# Altium project S7CAS-PLEIADES-CARTE-MERE.PrjPCB (part 1 of 3)
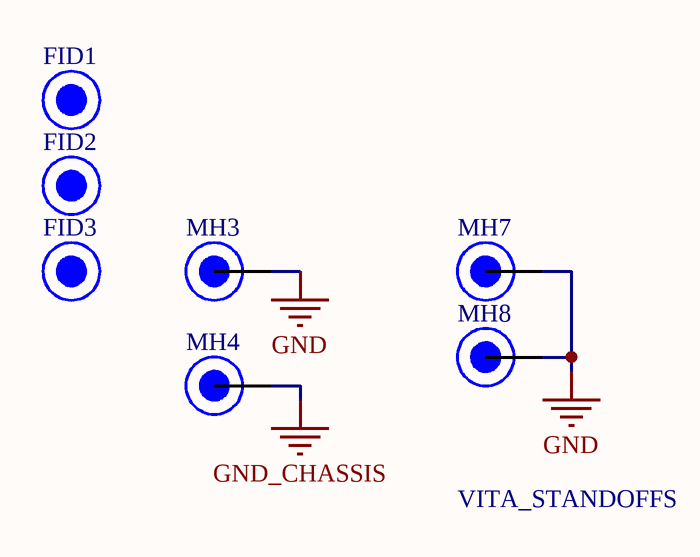
[diagram p0: CM_Title.SchDoc]
Project_Date: 2019-01-28; Project_DateCode: DCXXXX; Project_Designer1: Olivier Belval; Project_Designer2: Édouard Denommée; Project_Designer3: Philippe Marcoux; Project_Designer4: Anthony Paris; Project_Global: PLEIADES; Project_Group: P05; Project_Name: Carte Mère; Project_Revision: 1.000; Project_Stencil_Bot_Thickness: 0.1 MM; Project_Stencil_Top_Thickness: 0.1 MM
14 sheets, 327 parts. Net scope: flat (ports and power ports of the same name join across sheets).
Board file: CM_PCB.PcbDoc
Sheets:
  CM_Title.SchDoc
  CM_POWER_TREE.SchDoc
  CM_ALIM.SchDoc
  CM_FPGA_B0-1.SchDoc
  CM_FPGA_B2-3.SchDoc
  CM_FPGA_B4-5.SchDoc
  CM_FPGA_JTAG_POWER_FLASH.SchDoc
  CM_CLK.SchDoc
  CM_DDR3.SchDoc
  CM_MOTOR.SchDoc
  CM_ETHERNET.SchDoc
  CM_FMC-HPC-AB.SchDoc
  CM_FMC-HPC-CDE.SchDoc
  CM_USB.SchDoc

## Sheet CM_Title.SchDoc
size Tabloid; SheetNumber: 1; SheetTotal: 14; Sheet_Name: Insert name in Document Parameters; Size: 11x17

### Parts
FID1  Fiducial 1mm  [FID_1MM]  (value not drawn)  (no BOM)
FID2  Fiducial 1mm  [FID_1MM]  (value not drawn)  (no BOM)
FID3  Fiducial 1mm  [FID_1MM]  (value not drawn)  (no BOM)
MH3  Mounting Hole 6-32  [MH_ENG_6-32]  (value not drawn)  (no BOM)
MH4  Mounting Hole 6-32  [MH_ENG_6-32]  (value not drawn)  (no BOM)
MH7  2.7 mm  [MH_ENG_6-32]  (value not drawn)  (no BOM)
MH8  2.7 mm  [MH_ENG_6-32]  (value not drawn)  (no BOM)

### Nets
GND: MH3.1 MH7.1 MH8.1
GND_CHASSIS: MH4.1

### Notes on the sheet
- VITA_STANDOFFS
- Revision history
- Package size conversion
- Metric
- 1005
- 1608
- Imperial
- 0402
- 0603
- Revision
- 2012
- 3216
- 0805
- 1206
- 3225
- 6432
- 1210
- 2512
- Date :
- Project Title
- Global Project
- Size
- Group
- Date
- Sheet
- of
- Filename
- Designers

### Library data of the parts
FID1-FID3 = FID_1MM: FID - 1MM; Current: *; Mfg Part Number: *; HelpURL: *; CreatedBy: Jonathan Bouchard; VerifiedBy: Alexandre Imbeault; FootprintNameOK: Jonathan Bouchard; Temperature: *; Power: *; Precision: *; Value: *; Mfg: *; Package: *; Voltage: *
MH3 MH4 MH7 MH8 = MH_6-32: MH - Mounting Hole 6-32; Current: *; Mfg Part Number: *; HelpURL: *; CreatedBy: Jonathan Bouchard; VerifiedBy: Alexandre Imbeault; FootprintNameOK: Jonathan Bouchard; Temperature: *; Power: *; Precision: *; Value: *; Mfg: *; Package: *; Voltage: *

## Sheet CM_POWER_TREE.SchDoc
size Tabloid; SheetNumber: 2; SheetTotal: 14; Sheet_Name: Power tree
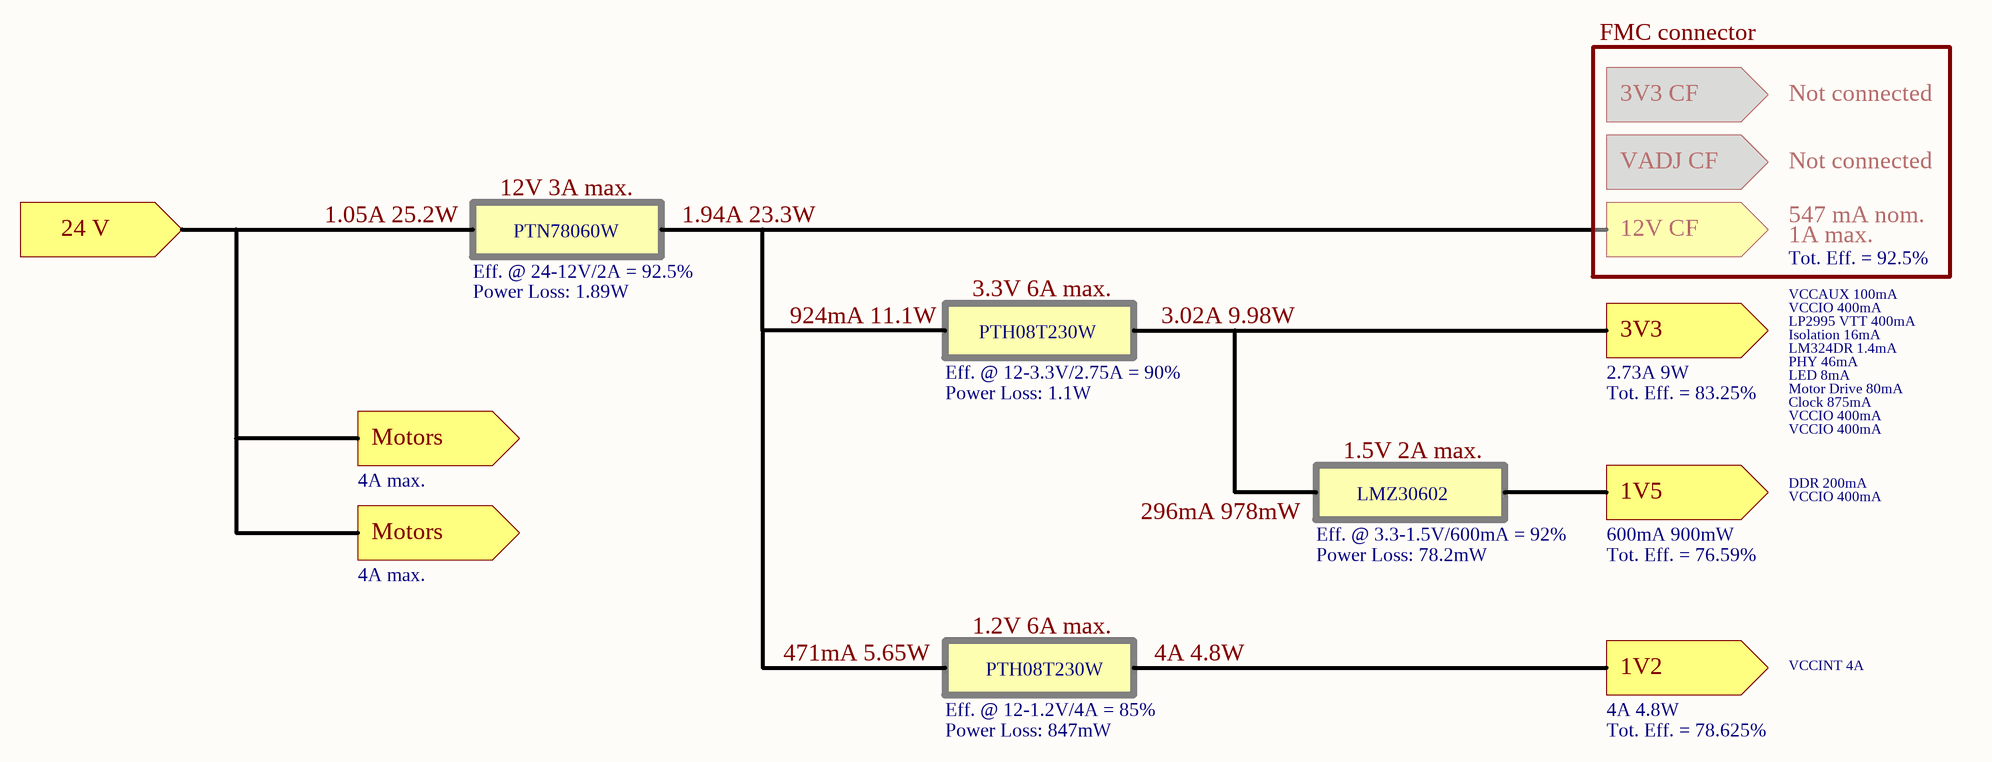
[diagram p1: CM_POWER_TREE.SchDoc]

### Notes on the sheet
- FMC connector
- 3V3 CF
- Not connected
- 12V 3A max.
- VADJ CF
- 24 V
- 1.05A 25.2W
- PTN78060W
- 1.94A 23.3W
- 12V CF
- 1A max.
- 547 mA nom.
- Tot. Eff. = 92.5%
- Eff. @ 24-12V/2A = 92.5%
- Power Loss: 1.89W
- 924mA 11.1W
- 3.3V 6A max.
- PTH08T230W
- 3.02A 9.98W
- 3V3
- VCCAUX 100mA
- VCCIO 400mA
- LP2995 VTT 400mA
- Isolation 16mA
- Eff. @ 12-3.3V/2.75A = 90%
- Power Loss: 1.1W
- Tot. Eff. = 83.25%
- 2.73A 9W
- LM324DR 1.4mA
- PHY 46mA
- LED 8mA
- Motor Drive 80mA
- Motors
- 1.5V 2A max.
- Clock 875mA
- 4A max.
- 296mA 978mW
- LMZ30602
- 1V5
- DDR 200mA
- Eff. @ 3.3-1.5V/600mA = 92%
- Power Loss: 78.2mW
- Tot. Eff. = 76.59%
- 600mA 900mW
- 471mA 5.65W
- 1.2V 6A max.
- 4A 4.8W
- VCCINT 4A
- Power Loss: 847mW
- Eff. @ 12-1.2V/4A = 85%
- Tot. Eff. = 78.625%
- 1V2
- Sheet Name
- Project Title
- Global Project
- Size
- Group
- Revision
- Date
- Sheet
- of
- Filename
- Designers

## Sheet CM_ALIM.SchDoc
size Tabloid; SheetNumber: 3; SheetTotal: 14; Size: 11x17; Sheet_Name: CM_ALIM
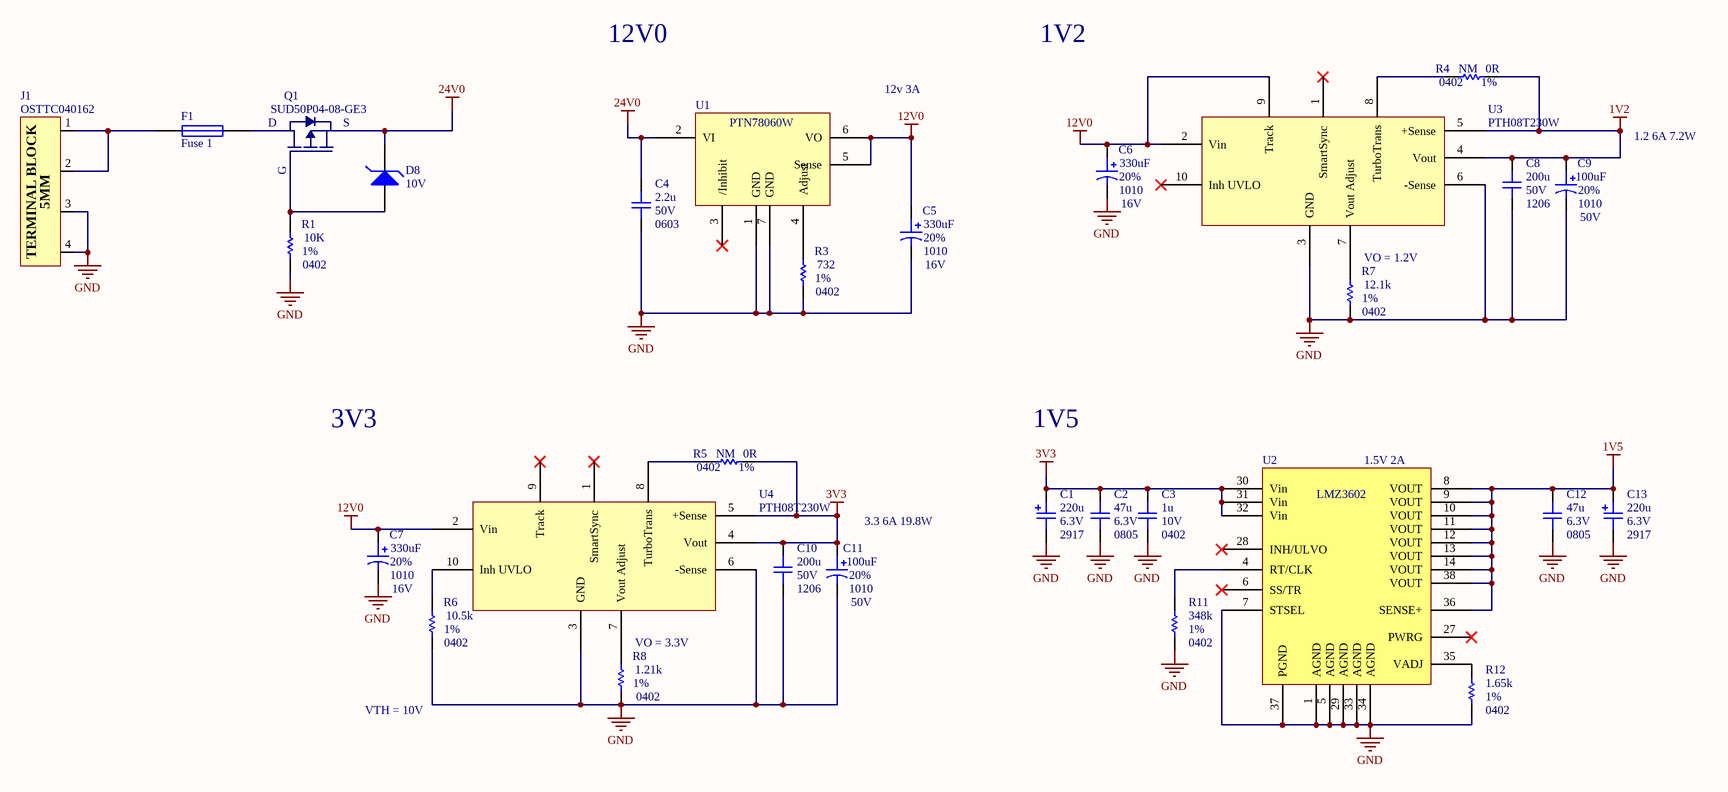
[diagram p2: CM_ALIM.SchDoc]

### Parts
C1  value 220u  Voltage: 6.3V  Package: 2917  [CAP_TAN_2917(D)]  (hidden comment: CAP - TANTALUM - CASE D)
C2  value 47u  Voltage: 6.3V  Package: 0805  [CAP_0805]  (hidden comment: CAP - 0805)
C3  value 1u  Voltage: 10V  Package: 0402  [CAP_0402]  (hidden comment: CAP - 0402)
C4  value 2.2u  Voltage: 50V  Package: 0603  [CAP_0603]  (hidden comment: CAP - 0603)
C5  value 330uF  Voltage: 16V  Package: 1010  Precision: 20%  [CAP_ALU_1010_vishay]  (hidden comment: MAL214699501E3)
C6  value 330uF  Voltage: 16V  Package: 1010  Precision: 20%  [CAP_ALU_1010_vishay]  (hidden comment: MAL214699501E3)
C7  value 330uF  Voltage: 16V  Package: 1010  Precision: 20%  [CAP_ALU_1010_vishay]  (hidden comment: MAL214699501E3)
C8  value 200u  Voltage: 50V  Package: 1206  [CAP_1206]  (hidden comment: CAP - 1206)
C9  value 100uF  Voltage: 50V  Package: 1010  Precision: 20%  [CAP_ALU_1010_vishay]  (hidden comment: MAL215099101E3)
C10  value 200u  Voltage: 50V  Package: 1206  [CAP_1206]  (hidden comment: CAP - 1206)
C11  value 100uF  Voltage: 50V  Package: 1010  Precision: 20%  [CAP_ALU_1010_vishay]  (hidden comment: MAL215099101E3)
C12  value 47u  Voltage: 6.3V  Package: 0805  [CAP_0805]  (hidden comment: CAP - 0805)
C13  value 220u  Voltage: 6.3V  Package: 2917  [CAP_TAN_2917(D)]  (hidden comment: CAP - TANTALUM - CASE D)
D8  Vz: 10V  [SOT23_N]  (hidden comment: ZENER BZX84C10LT1G)
F1  Fuse 1  [PIN-W2/E2.8]
J1  OSTTC040162  [CONN_TERMINAL_OSTTA040161]
Q1  SUD50P04-08-GE3  [TO-252]
R1  value 10K  Package: 0402  Precision: 1%  [RES_0402]  (hidden comment: RES - 0402)
R3  value 732  Package: 0402  Precision: 1%  [RES_0402]  (hidden comment: RES - 0402)
R4  NM  value 0R  Package: 0402  Precision: 1%  [RES_0402]
R5  NM  value 0R  Package: 0402  Precision: 1%  [RES_0402]
R6  value 10.5k  Package: 0402  Precision: 1%  [RES_0402]  (hidden comment: RES - 0402)
R7  value 12.1k  Package: 0402  Precision: 1%  [RES_0402]  (hidden comment: RES - 0402)
R8  value 1.21k  Package: 0402  Precision: 1%  [RES_0402]  (hidden comment: RES - 0402)
R11  value 348k  Package: 0402  Precision: 1%  [RES_0402]  (hidden comment: *)
R12  value 1.65k  Package: 0402  Precision: 1%  [RES_0402]  (hidden comment: *)
U1  PTN78060W  [EUW]
U2  LMZ3602  [RKG39 QFN]
U3  PTH08T230W  [PTH08T230W]
U4  PTH08T230W  [PTH08T230W]

### Nets
1V2: C8.2 C9.1 R4.1 U3.4(Vout) U3.5(+Sense)
1V5: C12.2 C13.2 U2.8(VOUT) U2.9(VOUT) U2.10(VOUT) U2.11(VOUT) U2.12(VOUT) U2.13(VOUT) U2.14(VOUT) U2.36(SENSE+) U2.38(VOUT)
3V3: C1.2 C2.2 C3.2 C10.2 C11.1 R5.1 U2.30(Vin) U2.31(Vin) U2.32(Vin) U4.4(Vout) U4.5(+Sense)
12V0: C5.1 C6.1 C7.1 U1.5(Sense) U1.6(VO) U3.2(Vin) U3.9(Track) U4.2(Vin)
24V0: C4.2 D8.3(K) Q1.S U1.2(VI)
GND: C1.1 C2.1 C3.1 C4.1 C5.2 C6.2 C7.2 C8.1 C9.2 C10.1 C11.2 C12.1 C13.1 J1.3 J1.4 R1.1 R3.1 R6.1 R7.1 R8.1 R11.1 R12.1 U1.1(GND) U1.7(GND) U2.1(AGND) U2.5(AGND) U2.7(STSEL) U2.29(AGND) U2.33(AGND) U2.34(AGND) U2.37(PGND) U3.3(GND) U3.6(-Sense) U4.3(GND) U4.6(-Sense)
NetD8_1: D8.1(A) Q1.G R1.2
NetF1_1: F1.1 J1.1 J1.2
NetF1_2: F1.2 Q1.D
NetR3_2: R3.2 U1.4(Adjust)
NetR4_2: R4.2 U3.8(TurboTrans)
NetR5_2: R5.2 U4.8(TurboTrans)
NetR6_2: R6.2 U4.10(Inh_UVLO)
NetR7_2: R7.2 U3.7(Vout_Adjust)
NetR8_2: R8.2 U4.7(Vout_Adjust)
NetR11_2: R11.2 U2.4(RT/CLK)
NetR12_2: R12.2 U2.35(VADJ)

Not connected (* = marked no-connect by the designer): U1 3(/Inhibit)*; U2 6(SS/TR)* 27(PWRG)* 28(INH/ULVO)*; U3 1(SmartSync)* 10(Inh_UVLO)*; U4 1(SmartSync)* 9(Track)*

### Notes on the sheet
- 12V0
- 1V2
- 12v 3A
- 1.2 6A 7.2W
- VO = 1.2V
- 3V3
- 1V5
- (near U2) 1.5V 2A
- (near C11) 3.3 6A 19.8W
- VO = 3.3V
- VTH = 10V
- Sheet Name
- Project Title
- Global Project
- Size
- Group
- Revision
- Date
- Sheet
- of
- Filename
- Designers
- (in symbol CONN_TERMINAL_OSTTC040162) TERMINAL BLOCK; 5MM

### Library data of the parts
C1 C13 = CAP_TANT_2917(D): CAP - TANTALUM - 2917; Precision: 10%; Current: *; CreatedBy: Jonathan Bouchard; Power: *
C2 C12 = CAP - 0805: Precision: 10%; Current: *; CreatedBy: Jonathan Bouchard; Power: *
C3 = CAP - 0402: Precision: 10%; Current: *; CreatedBy: Jonathan Bouchard; Power: *
C4 = CAP - 0603: Precision: 10%; Current: *; CreatedBy: Jonathan Bouchard; Power: *
C5-C7 = CAP_ALU_MAL214699501E3: CAP - ALU 330uF 20% 16V - 1010; Current: 750mA; Mfg: Vishay Dale; Mfg Part Number: MAL214699501E3; HelpURL: http://www.vishay.com/docs/28403/146cti.pdf; CreatedBy: Jonathan Bouchard; Temperature: -55°C to 125°C; Power: *; Supplier 1: Digikey; Supplier Part Number 1: 4405PHCT-ND
C8 C10 = CAP - 1206: Precision: 10%; Current: *; CreatedBy: Jonathan Bouchard; Power: *
C9 C11 = CAP_ALU_MAL215099101E3: CAP - ALU 100uF 20% 50V - 1010; Current: 490mA; Mfg: Vishay Dale; Mfg Part Number: MAL215099101E3; HelpURL: http://www.vishay.com/docs/28395/150crz.pdf; CreatedBy: Jonathan Bouchard; Temperature: -55°C to 125°C; Power: *; Supplier 1: Digikey; Supplier Part Number 1: 4399PHDKR-ND
D8 = ZENER BZX84C10LT1G: Zener Diode
F1 = Fuse 1: Fuse; Published: 8-Jun-2000; LatestRevisionDate: 17-Jul-2002; LatestRevisionNote: Re-released for DXP Platform.; PackageReference: PIN-W2/E2.8; Publisher: Altium Limited; PackageDescription: Thru-Hole; 2 Leads
J1 = CONN_TERMINAL_OSTTC040162: CONN -  TERMINAL BLOCK 4POS 5MM - TH; Mfg: On Shore Technology Inc.; Voltage: *; Current: *; Power: *; Mfg Part Number: OSTTC040162; HelpURL: http://www.on-shore.com/wp-content/uploads/2015/09/osttcxx0162.pdf; CreatedBy: Jonathan Bouchard; Temperature: -30°C ~ 105°C; Value: *; Precision: *; Package: TH-4; Supplier 1: Digikey; Supplier Part Number 1: ED2602-ND
Q1 = P-MOS SUD50P04-08-GE3: Supplier 1: Mouser; Supplier 2: Allied
R1 R3-R8 R11 R12 = RES - 0402: Voltage: 50V; Power: 1/16W; Current: *; CreatedBy: Jonathan Bouchard
U1 = PTN78060W: Wide input volate regulator; Output Current: 3A
U2 = LMZ3602: 2A Power Module

## Sheet CM_FPGA_B0-1.SchDoc
size Tabloid; SheetNumber: 4; SheetTotal: 14; Sheet_Name: CM_FPGA_B0-1; Size: 11x17
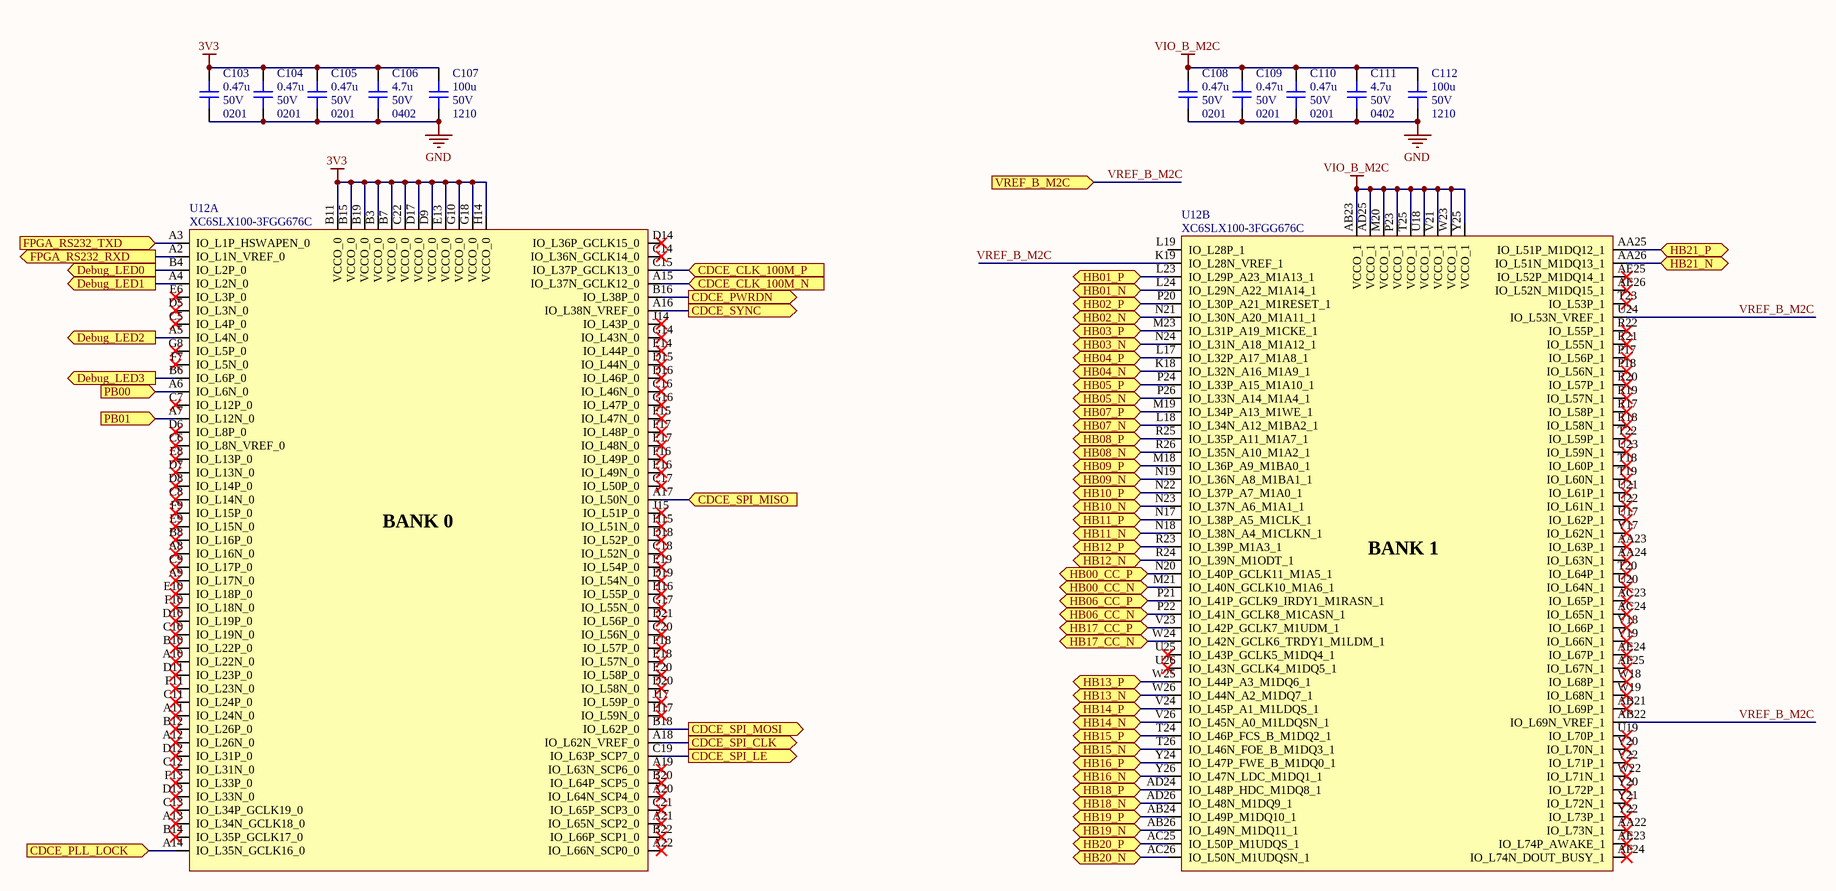
[diagram p3: CM_FPGA_B0-1.SchDoc]

### Parts
C103  value 0.47u  Voltage: 50V  Package: 0201  [CAP_0201]  (hidden comment: CAP - 0201)
C104  value 0.47u  Voltage: 50V  Package: 0201  [CAP_0201]  (hidden comment: CAP - 0201)
C105  value 0.47u  Voltage: 50V  Package: 0201  [CAP_0201]  (hidden comment: CAP - 0201)
C106  value 4.7u  Voltage: 50V  Package: 0402  [CAP_0402]  (hidden comment: CAP - 0402)
C107  value 100u  Voltage: 50V  Package: 1210  [CAP_1210]  (hidden comment: CAP - 1210)
C108  value 0.47u  Voltage: 50V  Package: 0201  [CAP_0201]  (hidden comment: CAP - 0201)
C109  value 0.47u  Voltage: 50V  Package: 0201  [CAP_0201]  (hidden comment: CAP - 0201)
C110  value 0.47u  Voltage: 50V  Package: 0201  [CAP_0201]  (hidden comment: CAP - 0201)
C111  value 4.7u  Voltage: 50V  Package: 0402  [CAP_0402]  (hidden comment: CAP - 0402)
C112  value 100u  Voltage: 50V  Package: 1210  [CAP_1210]  (hidden comment: CAP - 1210)
U12  XC6SLX100-3FGG676C  [FPGA_XILINX_FGG676]  (parts A,B of 10)

### Ports
CDCE_CLK_100M_N (in), CDCE_CLK_100M_P (in), CDCE_PLL_LOCK (in), CDCE_PWRDN (out), CDCE_SPI_CLK (out), CDCE_SPI_LE (out), CDCE_SPI_MISO (in), CDCE_SPI_MOSI (out), CDCE_SYNC (out), Debug_LED0 (out), Debug_LED1 (out), Debug_LED2 (out), Debug_LED3 (out), FPGA_RS232_RXD (out), FPGA_RS232_TXD (in), HB00_CC_N (bidir), HB00_CC_P (bidir), HB01_N (bidir), HB01_P (bidir), HB02_N (bidir), HB02_P (bidir), HB03_N (bidir), HB03_P (bidir), HB04_N (bidir), HB04_P (bidir), HB05_N (bidir), HB05_P (bidir), HB06_CC_N (bidir), HB06_CC_P (bidir), HB07_N (bidir), HB07_P (bidir), HB08_N (bidir), HB08_P (bidir), HB09_N (bidir), HB09_P (bidir), HB10_N (bidir), HB10_P (bidir), HB11_N (bidir), HB11_P (bidir), HB12_N (bidir), HB12_P (bidir), HB13_N (bidir), HB13_P (bidir), HB14_N (bidir), HB14_P (bidir), HB15_N (bidir), HB15_P (bidir), HB16_N (bidir), HB16_P (bidir), HB17_CC_N (bidir), HB17_CC_P (bidir), HB18_N (bidir), HB18_P (bidir), HB19_N (bidir), HB19_P (bidir), HB20_N (bidir), HB20_P (bidir), HB21_N (bidir), HB21_P (bidir), PB00 (in), PB01 (in), VREF_B_M2C (in)

### Nets
3V3: C103.2 C104.2 C105.2 C106.2 C107.2 U12.B3(VCCO_0) U12.B7(VCCO_0) U12.B11(VCCO_0) U12.B15(VCCO_0) U12.B19(VCCO_0) U12.C22(VCCO_0) U12.D9(VCCO_0) U12.D17(VCCO_0) U12.E13(VCCO_0) U12.G10(VCCO_0) U12.G18(VCCO_0) U12.H14(VCCO_0)
GND: C103.1 C104.1 C105.1 C106.1 C107.1 C108.1 C109.1 C110.1 C111.1 C112.1
VIO_B_M2C: C108.2 C109.2 C110.2 C111.2 C112.2 U12.AB23(VCCO_1) U12.AD25(VCCO_1) U12.M20(VCCO_1) U12.P23(VCCO_1) U12.T25(VCCO_1) U12.U18(VCCO_1) U12.V21(VCCO_1) U12.W23(VCCO_1) U12.Y25(VCCO_1)
CDCE_CLK_100M_N: U12.A15(IO_L37N_GCLK12_0) ; port CDCE_CLK_100M_N
CDCE_CLK_100M_P: U12.C15(IO_L37P_GCLK13_0) ; port CDCE_CLK_100M_P
CDCE_PLL_LOCK: U12.A14(IO_L35N_GCLK16_0) ; port CDCE_PLL_LOCK
CDCE_PWRDN: U12.B16(IO_L38P_0) ; port CDCE_PWRDN
CDCE_SPI_CLK: U12.A18(IO_L62N_VREF_0) ; port CDCE_SPI_CLK
CDCE_SPI_LE: U12.C19(IO_L63P_SCP7_0) ; port CDCE_SPI_LE
CDCE_SPI_MISO: U12.A17(IO_L50N_0) ; port CDCE_SPI_MISO
CDCE_SPI_MOSI: U12.B18(IO_L62P_0) ; port CDCE_SPI_MOSI
CDCE_SYNC: U12.A16(IO_L38N_VREF_0) ; port CDCE_SYNC
Debug_LED0: U12.B4(IO_L2P_0) ; port Debug_LED0
Debug_LED1: U12.A4(IO_L2N_0) ; port Debug_LED1
Debug_LED2: U12.A5(IO_L4N_0) ; port Debug_LED2
Debug_LED3: U12.B6(IO_L6P_0) ; port Debug_LED3
FPGA_RS232_RXD: U12.A2(IO_L1N_VREF_0) ; port FPGA_RS232_RXD
FPGA_RS232_TXD: U12.A3(IO_L1P_HSWAPEN_0) ; port FPGA_RS232_TXD
HB00_CC_N: U12.M21(IO_L40N_GCLK10_M1A6_1) ; port HB00_CC_N
HB00_CC_P: U12.N20(IO_L40P_GCLK11_M1A5_1) ; port HB00_CC_P
HB01_N: U12.L24(IO_L29N_A22_M1A14_1) ; port HB01_N
HB01_P: U12.L23(IO_L29P_A23_M1A13_1) ; port HB01_P
HB02_N: U12.N21(IO_L30N_A20_M1A11_1) ; port HB02_N
HB02_P: U12.P20(IO_L30P_A21_M1RESET_1) ; port HB02_P
HB03_N: U12.N24(IO_L31N_A18_M1A12_1) ; port HB03_N
HB03_P: U12.M23(IO_L31P_A19_M1CKE_1) ; port HB03_P
HB04_N: U12.K18(IO_L32N_A16_M1A9_1) ; port HB04_N
HB04_P: U12.L17(IO_L32P_A17_M1A8_1) ; port HB04_P
HB05_N: U12.P26(IO_L33N_A14_M1A4_1) ; port HB05_N
HB05_P: U12.P24(IO_L33P_A15_M1A10_1) ; port HB05_P
HB06_CC_N: U12.P22(IO_L41N_GCLK8_M1CASN_1) ; port HB06_CC_N
HB06_CC_P: U12.P21(IO_L41P_GCLK9_IRDY1_M1RASN_1) ; port HB06_CC_P
HB07_N: U12.L18(IO_L34N_A12_M1BA2_1) ; port HB07_N
HB07_P: U12.M19(IO_L34P_A13_M1WE_1) ; port HB07_P
HB08_N: U12.R26(IO_L35N_A10_M1A2_1) ; port HB08_N
HB08_P: U12.R25(IO_L35P_A11_M1A7_1) ; port HB08_P
HB09_N: U12.N19(IO_L36N_A8_M1BA1_1) ; port HB09_N
HB09_P: U12.M18(IO_L36P_A9_M1BA0_1) ; port HB09_P
HB10_N: U12.N23(IO_L37N_A6_M1A1_1) ; port HB10_N
HB10_P: U12.N22(IO_L37P_A7_M1A0_1) ; port HB10_P
HB11_N: U12.N18(IO_L38N_A4_M1CLKN_1) ; port HB11_N
HB11_P: U12.N17(IO_L38P_A5_M1CLK_1) ; port HB11_P
HB12_N: U12.R24(IO_L39N_M1ODT_1) ; port HB12_N
HB12_P: U12.R23(IO_L39P_M1A3_1) ; port HB12_P
HB13_N: U12.W26(IO_L44N_A2_M1DQ7_1) ; port HB13_N
HB13_P: U12.W25(IO_L44P_A3_M1DQ6_1) ; port HB13_P
HB14_N: U12.V26(IO_L45N_A0_M1LDQSN_1) ; port HB14_N
HB14_P: U12.V24(IO_L45P_A1_M1LDQS_1) ; port HB14_P
HB15_N: U12.T26(IO_L46N_FOE_B_M1DQ3_1) ; port HB15_N
HB15_P: U12.T24(IO_L46P_FCS_B_M1DQ2_1) ; port HB15_P
HB16_N: U12.Y26(IO_L47N_LDC_M1DQ1_1) ; port HB16_N
HB16_P: U12.Y24(IO_L47P_FWE_B_M1DQ0_1) ; port HB16_P
HB17_CC_N: U12.W24(IO_L42N_GCLK6_TRDY1_M1LDM_1) ; port HB17_CC_N
HB17_CC_P: U12.V23(IO_L42P_GCLK7_M1UDM_1) ; port HB17_CC_P
HB18_N: U12.AD26(IO_L48N_M1DQ9_1) ; port HB18_N
HB18_P: U12.AD24(IO_L48P_HDC_M1DQ8_1) ; port HB18_P
HB19_N: U12.AB26(IO_L49N_M1DQ11_1) ; port HB19_N
HB19_P: U12.AB24(IO_L49P_M1DQ10_1) ; port HB19_P
HB20_N: U12.AC26(IO_L50N_M1UDQSN_1) ; port HB20_N
HB20_P: U12.AC25(IO_L50P_M1UDQS_1) ; port HB20_P
HB21_N: U12.AA26(IO_L51N_M1DQ13_1) ; port HB21_N
HB21_P: U12.AA25(IO_L51P_M1DQ12_1) ; port HB21_P
PB00: U12.A6(IO_L6N_0) ; port PB00
PB01: U12.A7(IO_L12N_0) ; port PB01
VREF_B_M2C: U12.AB22(IO_L69N_VREF_1) U12.K19(IO_L28N_VREF_1) U12.U24(IO_L53N_VREF_1) ; port VREF_B_M2C

Not connected (* = marked no-connect by the designer): U12 A8(IO_L16N_0)* A9(IO_L17N_0)* A10(IO_L22N_0)* A11(IO_L24N_0)* A12(IO_L26N_0)* A13(IO_L34N_GCLK18_0)* A19(IO_L63N_SCP6_0)* A20(IO_L64N_SCP4_0)* A21(IO_L65N_SCP2_0)* A22(IO_L66N_SCP0_0)* AA22(IO_L73N_1)* AA23(IO_L63P_1)* AA24(IO_L63N_1)* AB21(IO_L69P_1)* AC23(IO_L65P_1)* AC24(IO_L65N_1)* AE23(IO_L74P_AWAKE_1)* AE24(IO_L67P_1)* AE25(IO_L52P_M1DQ14_1)* AE26(IO_L52N_M1DQ15_1)* AF24(IO_L74N_DOUT_BUSY_1)* AF25(IO_L67N_1)* B8(IO_L16P_0)* B10(IO_L22P_0)* B12(IO_L26P_0)* B14(IO_L35P_GCLK17_0)* B20(IO_L64P_SCP5_0)* B22(IO_L66P_SCP1_0)* C5(IO_L4P_0)* C6(IO_L8N_VREF_0)* C7(IO_L12P_0)* C8(IO_L14N_0)* C9(IO_L17P_0)* C10(IO_L19N_0)* C11(IO_L24P_0)* C12(IO_L31N_0)* C13(IO_L34P_GCLK19_0)* C14(IO_L36N_GCLK14_0)* C16(IO_L46N_0)* C17(IO_L50P_0)* C18(IO_L52N_0)* C20(IO_L56N_0)* C21(IO_L65P_SCP3_0)* D5(IO_L3N_0)* D6(IO_L8P_0)* D7(IO_L13N_0)* D8(IO_L14P_0)* D10(IO_L19P_0)* D11(IO_L23P_0)* D12(IO_L31P_0)* D13(IO_L33N_0)* D14(IO_L36P_GCLK15_0)* D15(IO_L44N_0)* D16(IO_L46P_0)* D18(IO_L52P_0)* D19(IO_L54N_0)* D20(IO_L58N_0)* D21(IO_L56P_0)* E6(IO_L3P_0)* E8(IO_L13P_0)* E9(IO_L15N_0)* E10(IO_L18P_0)* E14(IO_L44P_0)* E16(IO_L49N_0)* E17(IO_L48N_0)* E18(IO_L57N_0)* E19(IO_L54P_0)* E20(IO_L58P_0)* F7(IO_L5N_0)* F9(IO_L15P_0)* F10(IO_L18N_0)* F11(IO_L23N_0)* F13(IO_L33P_0)* F15(IO_L47N_0)* F16(IO_L49P_0)* F17(IO_L48P_0)* F18(IO_L57P_0)* G8(IO_L5P_0)* G14(IO_L43N_0)* G16(IO_L47P_0)* G17(IO_L55N_0)* H15(IO_L51N_0)* H16(IO_L55P_0)* H17(IO_L59N_0)* J14(IO_L43P_0)* J15(IO_L51P_0)* J17(IO_L59P_0)* L19(IO_L28P_1) P17(IO_L56P_1)* P18(IO_L56N_1)* R17(IO_L58P_1)* R18(IO_L58N_1)* R19(IO_L57N_1)* R20(IO_L57P_1)* R21(IO_L55N_1)* R22(IO_L55P_1)* T18(IO_L60P_1)* T19(IO_L60N_1)* T20(IO_L64P_1)* T22(IO_L59P_1)* T23(IO_L53P_1)* U17(IO_L62P_1)* U19(IO_L70P_1)* U20(IO_L64N_1)* U21(IO_L61P_1)* U22(IO_L61N_1)* U23(IO_L59N_1)* U25(IO_L43P_GCLK5_M1DQ4_1)* U26(IO_L43N_GCLK4_M1DQ5_1)* V17(IO_L62N_1)* V18(IO_L66P_1)* V19(IO_L66N_1)* V20(IO_L70N_1)* V22(IO_L71P_1)* W18(IO_L68P_1)* W19(IO_L68N_1)* W22(IO_L71N_1)* Y20(IO_L72P_1)* Y21(IO_L72N_1)* Y22(IO_L73P_1)*

### Notes on the sheet
- Sheet Name
- Project Title
- Global Project
- Size
- Group
- Revision
- Date
- Sheet
- of
- Filename
- Designers
- (in symbol FPGA_XC6SLX100-3FGG676C, part A) BANK 0
- (in symbol FPGA_XC6SLX100-3FGG676C, part B) BANK 1

### Library data of the parts
C103-C105 C108-C110 = CAP - 0201: Precision: 10%; Current: *; CreatedBy: Jonathan Bouchard; Power: *
C106 C111 = CAP - 0402: Precision: 10%; Current: *; CreatedBy: Jonathan Bouchard; Power: *
C107 C112 = CAP - 1210: Precision: 10%; Current: *; CreatedBy: Jonathan Bouchard; Power: *
U12 = FPGA_XC6SLX100-3FGG676C: FPGA - XILINX SPARTAN 6 480 I/O - BGA-676; Voltage: 1.14 V ~ 1.26 V; Current: *; Power: *; Mfg: Xilinx; Mfg Part Number: XC6SLX100-3FGG676C; HelpURL: https://www.xilinx.com/support/documentation/data_sheets/ds162.pdf; CreatedBy: Jonathan Bouchard; Temperature: 0°C ~ 85°C (TJ); Value: *; Precision: *; Package: BGA-676; Supplier 1: Digikey; Supplier Part Number 1: 122-1760-ND

## Sheet CM_FPGA_B2-3.SchDoc
size Tabloid; SheetNumber: 5; SheetTotal: 14; Sheet_Name: CM_FPGA_B2-3; Size: 11x17
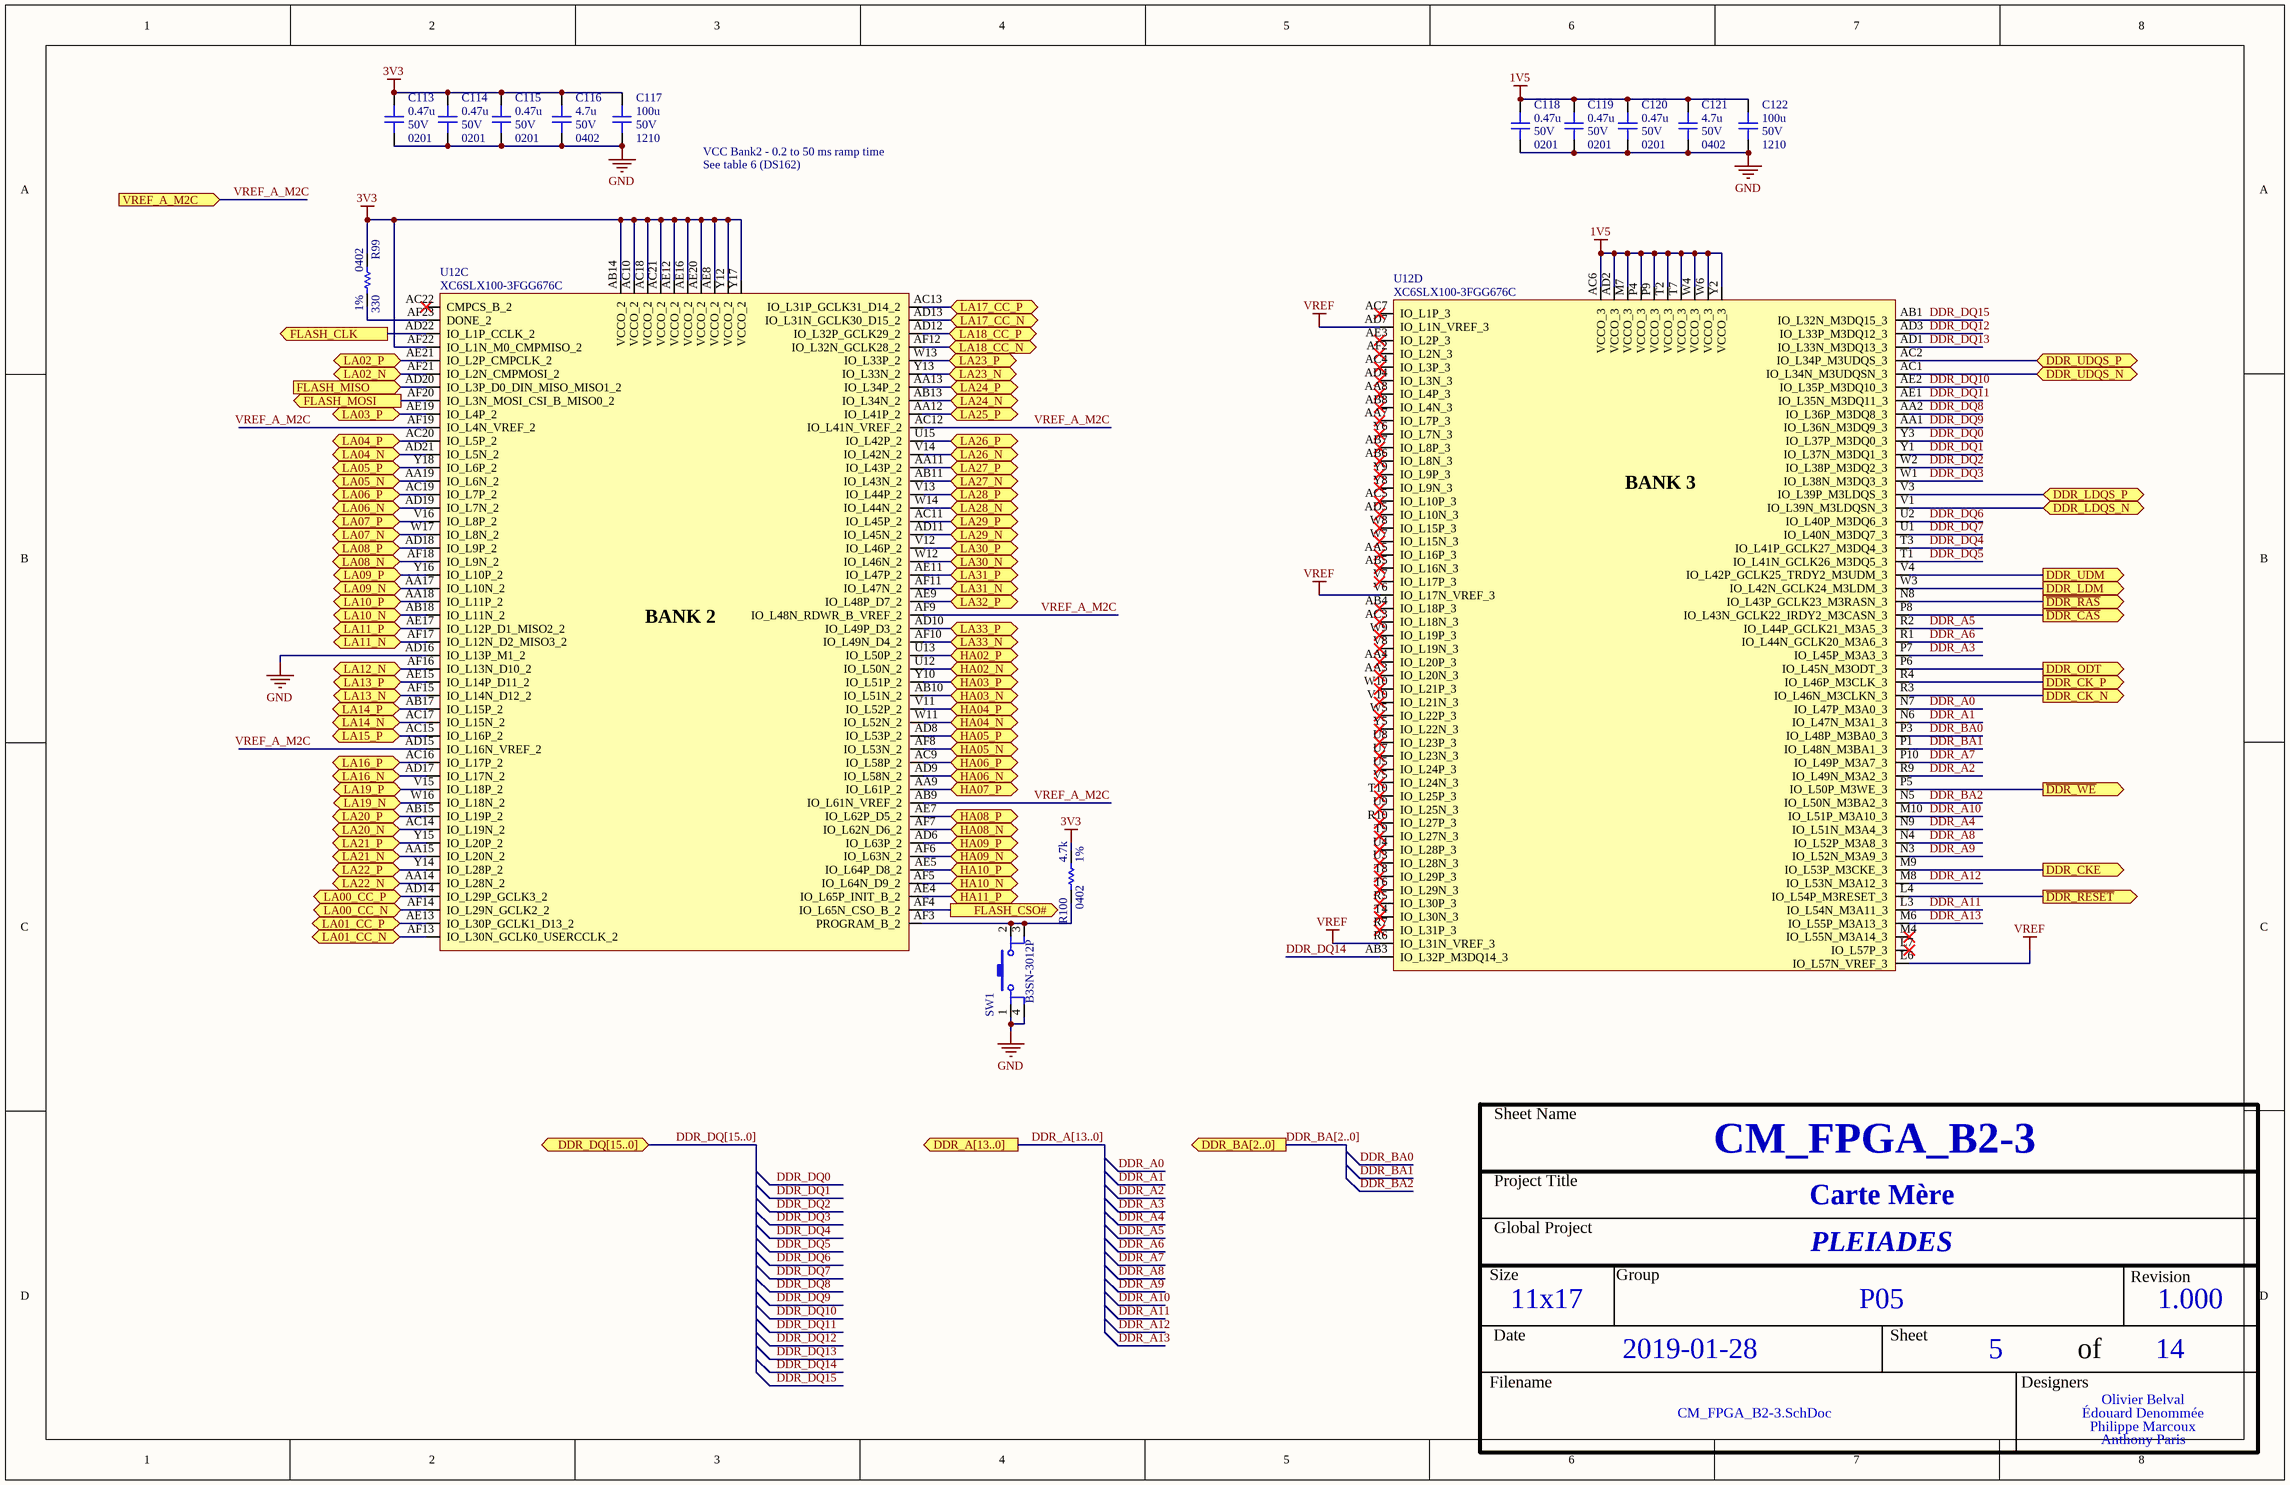
[diagram p4: CM_FPGA_B2-3.SchDoc]

### Parts
C113  value 0.47u  Voltage: 50V  Package: 0201  [CAP_0201]  (hidden comment: CAP - 0201)
C114  value 0.47u  Voltage: 50V  Package: 0201  [CAP_0201]  (hidden comment: CAP - 0201)
C115  value 0.47u  Voltage: 50V  Package: 0201  [CAP_0201]  (hidden comment: CAP - 0201)
C116  value 4.7u  Voltage: 50V  Package: 0402  [CAP_0402]  (hidden comment: CAP - 0402)
C117  value 100u  Voltage: 50V  Package: 1210  [CAP_1210]  (hidden comment: CAP - 1210)
C118  value 0.47u  Voltage: 50V  Package: 0201  [CAP_0201]  (hidden comment: CAP - 0201)
C119  value 0.47u  Voltage: 50V  Package: 0201  [CAP_0201]  (hidden comment: CAP - 0201)
C120  value 0.47u  Voltage: 50V  Package: 0201  [CAP_0201]  (hidden comment: CAP - 0201)
C121  value 4.7u  Voltage: 50V  Package: 0402  [CAP_0402]  (hidden comment: CAP - 0402)
C122  value 100u  Voltage: 50V  Package: 1210  [CAP_1210]  (hidden comment: CAP - 1210)
R99  value 330  Package: 0402  Precision: 1%  [RES_0402]  (hidden comment: RES - 0402)
R100  value 4.7k  Package: 0402  Precision: 1%  [RES_0402]  (hidden comment: RES - 0402)
SW1  B3SN-3012P  [SWI_TACT_B3SN-3012P]
U12  XC6SLX100-3FGG676C  [FPGA_XILINX_FGG676]  (parts C,D of 10)

### Ports
DDR_A[13..0] (out), DDR_BA[2..0] (out), DDR_CK_N (out), DDR_CK_P (out), DDR_CKE (out), DDR_DQ[15..0] (bidir), DDR_LDM (out), DDR_LDQS_N (bidir), DDR_LDQS_P (bidir), DDR_ODT (out), DDR_UDM (out), DDR_UDQS_N (bidir), DDR_UDQS_P (bidir), FLASH_CLK (out), FLASH_CSO# (out), FLASH_MISO (in), FLASH_MOSI (out), HA02_N (bidir), HA02_P (bidir), HA03_N (bidir), HA03_P (bidir), HA04_N (bidir), HA04_P (bidir), HA05_N (bidir), HA05_P (bidir), HA06_N (bidir), HA06_P (bidir), HA07_P (bidir), HA08_N (bidir), HA08_P (bidir), HA09_N (bidir), HA09_P (bidir), HA10_N (bidir), HA10_P (bidir), HA11_P (bidir), LA00_CC_N (bidir), LA00_CC_P (bidir), LA01_CC_N (bidir), LA01_CC_P (bidir), LA02_N (bidir), LA02_P (bidir), LA03_P (bidir), LA04_N (bidir), LA04_P (bidir), LA05_N (bidir), LA05_P (bidir), LA06_N (bidir), LA06_P (bidir), LA07_N (bidir), LA07_P (bidir), LA08_N (bidir), LA08_P (bidir), LA09_N (bidir), LA09_P (bidir), LA10_N (bidir), LA10_P (bidir), LA11_N (bidir), LA11_P (bidir), LA12_N (bidir), LA13_N (bidir), LA13_P (bidir), LA14_N (bidir), LA14_P (bidir), LA15_P (bidir), LA16_N (bidir), LA16_P (bidir), LA17_CC_N (bidir), LA17_CC_P (bidir), LA18_CC_N (bidir), LA18_CC_P (bidir), LA19_N (bidir), LA19_P (bidir), LA20_N (bidir), LA20_P (bidir), LA21_N (bidir), LA21_P (bidir), LA22_N (bidir), LA22_P (bidir), LA23_N (bidir), LA23_P (bidir), LA24_N (bidir), LA24_P (bidir), LA25_P (bidir), LA26_N (bidir), LA26_P (bidir), LA27_N (bidir), LA27_P (bidir), LA28_N (bidir), LA28_P (bidir), LA29_N (bidir), LA29_P (bidir), LA30_N (bidir), LA30_P (bidir), LA31_N (bidir), LA31_P (bidir), LA32_P (bidir), LA33_N (bidir), LA33_P (bidir), VREF_A_M2C (in), ~{DDR_CAS} (out), ~{DDR_RAS} (out), ~{DDR_RESET} (out), ~{DDR_WE} (out)

### Nets
1V5: C118.2 C119.2 C120.2 C121.2 C122.2 U12.AC6(VCCO_3) U12.AD2(VCCO_3) U12.M7(VCCO_3) U12.P4(VCCO_3) U12.P9(VCCO_3) U12.T2(VCCO_3) U12.T7(VCCO_3) U12.W4(VCCO_3) U12.W6(VCCO_3) U12.Y2(VCCO_3)
3V3: C113.2 C114.2 C115.2 C116.2 C117.2 R99.1 R100.2 U12.AB14(VCCO_2) U12.AC10(VCCO_2) U12.AC18(VCCO_2) U12.AC21(VCCO_2) U12.AE8(VCCO_2) U12.AE12(VCCO_2) U12.AE16(VCCO_2) U12.AE20(VCCO_2) U12.AF22(IO_L1N_M0_CMPMISO_2) U12.Y12(VCCO_2) U12.Y17(VCCO_2)
GND: C113.1 C114.1 C115.1 C116.1 C117.1 C118.1 C119.1 C120.1 C121.1 C122.1 SW1.1 SW1.4 U12.AD16(IO_L13P_M1_2)
VREF: U12.AD7(IO_L1N_VREF_3) U12.L6(IO_L57N_VREF_3) U12.R6(IO_L31N_VREF_3) U12.V6(IO_L17N_VREF_3)
~{DDR_CAS}: U12.P8(IO_L43N_GCLK22_IRDY2_M3CASN_3) ; port ~{DDR_CAS}
~{DDR_RAS}: U12.N8(IO_L43P_GCLK23_M3RASN_3) ; port ~{DDR_RAS}
~{DDR_RESET}: U12.L4(IO_L54P_M3RESET_3) ; port ~{DDR_RESET}
~{DDR_WE}: U12.P5(IO_L50P_M3WE_3) ; port ~{DDR_WE}
DDR_A0: U12.N7(IO_L47P_M3A0_3)
DDR_A1: U12.N6(IO_L47N_M3A1_3)
DDR_A2: U12.R9(IO_L49N_M3A2_3)
DDR_A3: U12.P7(IO_L45P_M3A3_3)
DDR_A4: U12.N9(IO_L51N_M3A4_3)
DDR_A5: U12.R2(IO_L44P_GCLK21_M3A5_3)
DDR_A6: U12.R1(IO_L44N_GCLK20_M3A6_3)
DDR_A7: U12.P10(IO_L49P_M3A7_3)
DDR_A8: U12.N4(IO_L52P_M3A8_3)
DDR_A9: U12.N3(IO_L52N_M3A9_3)
DDR_A10: U12.M10(IO_L51P_M3A10_3)
DDR_A11: U12.L3(IO_L54N_M3A11_3)
DDR_A12: U12.M8(IO_L53N_M3A12_3)
DDR_A13: U12.M6(IO_L55P_M3A13_3)
DDR_BA0: U12.P3(IO_L48P_M3BA0_3)
DDR_BA1: U12.P1(IO_L48N_M3BA1_3)
DDR_BA2: U12.N5(IO_L50N_M3BA2_3)
DDR_CK_N: U12.R3(IO_L46N_M3CLKN_3) ; port DDR_CK_N
DDR_CK_P: U12.R4(IO_L46P_M3CLK_3) ; port DDR_CK_P
DDR_CKE: U12.M9(IO_L53P_M3CKE_3) ; port DDR_CKE
DDR_DQ0: U12.Y3(IO_L37P_M3DQ0_3)
DDR_DQ1: U12.Y1(IO_L37N_M3DQ1_3)
DDR_DQ2: U12.W2(IO_L38P_M3DQ2_3)
DDR_DQ3: U12.W1(IO_L38N_M3DQ3_3)
DDR_DQ4: U12.T3(IO_L41P_GCLK27_M3DQ4_3)
DDR_DQ5: U12.T1(IO_L41N_GCLK26_M3DQ5_3)
DDR_DQ6: U12.U2(IO_L40P_M3DQ6_3)
DDR_DQ7: U12.U1(IO_L40N_M3DQ7_3)
DDR_DQ8: U12.AA2(IO_L36P_M3DQ8_3)
DDR_DQ9: U12.AA1(IO_L36N_M3DQ9_3)
DDR_DQ10: U12.AE2(IO_L35P_M3DQ10_3)
DDR_DQ11: U12.AE1(IO_L35N_M3DQ11_3)
DDR_DQ12: U12.AD3(IO_L33P_M3DQ12_3)
DDR_DQ13: U12.AD1(IO_L33N_M3DQ13_3)
DDR_DQ14: U12.AB3(IO_L32P_M3DQ14_3)
DDR_DQ15: U12.AB1(IO_L32N_M3DQ15_3)
DDR_LDM: U12.W3(IO_L42N_GCLK24_M3LDM_3) ; port DDR_LDM
DDR_LDQS_N: U12.V1(IO_L39N_M3LDQSN_3) ; port DDR_LDQS_N
DDR_LDQS_P: U12.V3(IO_L39P_M3LDQS_3) ; port DDR_LDQS_P
DDR_ODT: U12.P6(IO_L45N_M3ODT_3) ; port DDR_ODT
DDR_UDM: U12.V4(IO_L42P_GCLK25_TRDY2_M3UDM_3) ; port DDR_UDM
DDR_UDQS_N: U12.AC1(IO_L34N_M3UDQSN_3) ; port DDR_UDQS_N
DDR_UDQS_P: U12.AC2(IO_L34P_M3UDQS_3) ; port DDR_UDQS_P
FLASH_CLK: U12.AD22(IO_L1P_CCLK_2) ; port FLASH_CLK
FLASH_CSO#: U12.AF4(IO_L65N_CSO_B_2) ; port FLASH_CSO#
FLASH_MISO: U12.AD20(IO_L3P_D0_DIN_MISO_MISO1_2) ; port FLASH_MISO
FLASH_MOSI: U12.AF20(IO_L3N_MOSI_CSI_B_MISO0_2) ; port FLASH_MOSI
HA02_N: U12.U12(IO_L50N_2) ; port HA02_N
HA02_P: U12.U13(IO_L50P_2) ; port HA02_P
HA03_N: U12.AB10(IO_L51N_2) ; port HA03_N
HA03_P: U12.Y10(IO_L51P_2) ; port HA03_P
HA04_N: U12.W11(IO_L52N_2) ; port HA04_N
HA04_P: U12.V11(IO_L52P_2) ; port HA04_P
HA05_N: U12.AF8(IO_L53N_2) ; port HA05_N
HA05_P: U12.AD8(IO_L53P_2) ; port HA05_P
HA06_N: U12.AD9(IO_L58N_2) ; port HA06_N
HA06_P: U12.AC9(IO_L58P_2) ; port HA06_P
HA07_P: U12.AA9(IO_L61P_2) ; port HA07_P
HA08_N: U12.AF7(IO_L62N_D6_2) ; port HA08_N
HA08_P: U12.AE7(IO_L62P_D5_2) ; port HA08_P
HA09_N: U12.AF6(IO_L63N_2) ; port HA09_N
HA09_P: U12.AD6(IO_L63P_2) ; port HA09_P
HA10_N: U12.AF5(IO_L64N_D9_2) ; port HA10_N
HA10_P: U12.AE5(IO_L64P_D8_2) ; port HA10_P
HA11_P: U12.AE4(IO_L65P_INIT_B_2) ; port HA11_P
LA00_CC_N: U12.AF14(IO_L29N_GCLK2_2) ; port LA00_CC_N
LA00_CC_P: U12.AD14(IO_L29P_GCLK3_2) ; port LA00_CC_P
LA01_CC_N: U12.AF13(IO_L30N_GCLK0_USERCCLK_2) ; port LA01_CC_N
LA01_CC_P: U12.AE13(IO_L30P_GCLK1_D13_2) ; port LA01_CC_P
LA02_N: U12.AF21(IO_L2N_CMPMOSI_2) ; port LA02_N
LA02_P: U12.AE21(IO_L2P_CMPCLK_2) ; port LA02_P
LA03_P: U12.AE19(IO_L4P_2) ; port LA03_P
LA04_N: U12.AD21(IO_L5N_2) ; port LA04_N
LA04_P: U12.AC20(IO_L5P_2) ; port LA04_P
LA05_N: U12.AA19(IO_L6N_2) ; port LA05_N
LA05_P: U12.Y18(IO_L6P_2) ; port LA05_P
LA06_N: U12.AD19(IO_L7N_2) ; port LA06_N
LA06_P: U12.AC19(IO_L7P_2) ; port LA06_P
LA07_N: U12.W17(IO_L8N_2) ; port LA07_N
LA07_P: U12.V16(IO_L8P_2) ; port LA07_P
LA08_N: U12.AF18(IO_L9N_2) ; port LA08_N
LA08_P: U12.AD18(IO_L9P_2) ; port LA08_P
LA09_N: U12.AA17(IO_L10N_2) ; port LA09_N
LA09_P: U12.Y16(IO_L10P_2) ; port LA09_P
LA10_N: U12.AB18(IO_L11N_2) ; port LA10_N
LA10_P: U12.AA18(IO_L11P_2) ; port LA10_P
LA11_N: U12.AF17(IO_L12N_D2_MISO3_2) ; port LA11_N
LA11_P: U12.AE17(IO_L12P_D1_MISO2_2) ; port LA11_P
LA12_N: U12.AF16(IO_L13N_D10_2) ; port LA12_N
LA13_N: U12.AF15(IO_L14N_D12_2) ; port LA13_N
LA13_P: U12.AE15(IO_L14P_D11_2) ; port LA13_P
LA14_N: U12.AC17(IO_L15N_2) ; port LA14_N
LA14_P: U12.AB17(IO_L15P_2) ; port LA14_P
LA15_P: U12.AC15(IO_L16P_2) ; port LA15_P
LA16_N: U12.AD17(IO_L17N_2) ; port LA16_N
LA16_P: U12.AC16(IO_L17P_2) ; port LA16_P
LA17_CC_N: U12.AD13(IO_L31N_GCLK30_D15_2) ; port LA17_CC_N
LA17_CC_P: U12.AC13(IO_L31P_GCLK31_D14_2) ; port LA17_CC_P
LA18_CC_N: U12.AF12(IO_L32N_GCLK28_2) ; port LA18_CC_N
LA18_CC_P: U12.AD12(IO_L32P_GCLK29_2) ; port LA18_CC_P
LA19_N: U12.W16(IO_L18N_2) ; port LA19_N
LA19_P: U12.V15(IO_L18P_2) ; port LA19_P
LA20_N: U12.AC14(IO_L19N_2) ; port LA20_N
LA20_P: U12.AB15(IO_L19P_2) ; port LA20_P
LA21_N: U12.AA15(IO_L20N_2) ; port LA21_N
LA21_P: U12.Y15(IO_L20P_2) ; port LA21_P
LA22_N: U12.AA14(IO_L28N_2) ; port LA22_N
LA22_P: U12.Y14(IO_L28P_2) ; port LA22_P
LA23_N: U12.Y13(IO_L33N_2) ; port LA23_N
LA23_P: U12.W13(IO_L33P_2) ; port LA23_P
LA24_N: U12.AB13(IO_L34N_2) ; port LA24_N
LA24_P: U12.AA13(IO_L34P_2) ; port LA24_P
LA25_P: U12.AA12(IO_L41P_2) ; port LA25_P
LA26_N: U12.V14(IO_L42N_2) ; port LA26_N
LA26_P: U12.U15(IO_L42P_2) ; port LA26_P
LA27_N: U12.AB11(IO_L43N_2) ; port LA27_N
LA27_P: U12.AA11(IO_L43P_2) ; port LA27_P
LA28_N: U12.W14(IO_L44N_2) ; port LA28_N
LA28_P: U12.V13(IO_L44P_2) ; port LA28_P
LA29_N: U12.AD11(IO_L45N_2) ; port LA29_N
LA29_P: U12.AC11(IO_L45P_2) ; port LA29_P
LA30_N: U12.W12(IO_L46N_2) ; port LA30_N
LA30_P: U12.V12(IO_L46P_2) ; port LA30_P
LA31_N: U12.AF11(IO_L47N_2) ; port LA31_N
LA31_P: U12.AE11(IO_L47P_2) ; port LA31_P
LA32_P: U12.AE9(IO_L48P_D7_2) ; port LA32_P
LA33_N: U12.AF10(IO_L49N_D4_2) ; port LA33_N
LA33_P: U12.AD10(IO_L49P_D3_2) ; port LA33_P
VREF_A_M2C: U12.AB9(IO_L61N_VREF_2) U12.AC12(IO_L41N_VREF_2) U12.AD15(IO_L16N_VREF_2) U12.AF9(IO_L48N_RDWR_B_VREF_2) U12.AF19(IO_L4N_VREF_2) ; port VREF_A_M2C
NetR99_2: R99.2 U12.AF23(DONE_2)
NetR100_1: R100.1 SW1.2 SW1.3 U12.AF3(PROGRAM_B_2)

Not connected (* = marked no-connect by the designer): U12 AA3(IO_L20N_3)* AA4(IO_L20P_3)* AA5(IO_L16P_3)* AA7(IO_L7P_3)* AA8(IO_L4P_3)* AB4(IO_L18P_3)* AB5(IO_L16N_3)* AB6(IO_L8N_3)* AB7(IO_L8P_3)* AB8(IO_L4N_3)* AC3(IO_L18N_3)* AC4(IO_L3P_3)* AC5(IO_L10P_3)* AC7(IO_L1P_3)* AC22(CMPCS_B_2)* AD4(IO_L3N_3)* AD5(IO_L10N_3)* AE3(IO_L2P_3)* AF2(IO_L2N_3)* L7(IO_L57P_3)* M4(IO_L55N_M3A14_3)* R5(IO_L30P_3)* R7(IO_L31P_3)* R10(IO_L27P_3)* T4(IO_L30N_3)* T6(IO_L29N_3)* T8(IO_L29P_3)* T9(IO_L27N_3)* T10(IO_L25P_3)* U3(IO_L28N_3)* U4(IO_L28P_3)* U5(IO_L24P_3)* U7(IO_L23N_3)* U8(IO_L23P_3)* U9(IO_L25N_3)* V5(IO_L24N_3)* V7(IO_L17P_3)* V8(IO_L19N_3)* V10(IO_L21N_3)* W5(IO_L22P_3)* W7(IO_L15N_3)* W8(IO_L15P_3)* W9(IO_L19P_3)* W10(IO_L21P_3)* Y5(IO_L22N_3)* Y6(IO_L7N_3)* Y8(IO_L9N_3)* Y9(IO_L9P_3)*

### Buses and harness runs
bus DDR_A[13..0] = port DDR_A[13..0]
bus DDR_BA[2..0] = port DDR_BA[2..0]
bus DDR_DQ[15..0] = port DDR_DQ[15..0]

### Notes on the sheet
- VCC Bank2 - 0.2 to 50 ms ramp time
- See table 6 (DS162)
- Sheet Name
- Project Title
- Global Project
- Size
- Group
- Revision
- Date
- Sheet
- of
- Filename
- Designers
- (in symbol FPGA_XC6SLX100-3FGG676C, part C) BANK 2
- (in symbol FPGA_XC6SLX100-3FGG676C, part D) BANK 3

### Library data of the parts
C113-C115 C118-C120 = CAP - 0201: Precision: 10%; Current: *; CreatedBy: Jonathan Bouchard; Power: *
C116 C121 = CAP - 0402: Precision: 10%; Current: *; CreatedBy: Jonathan Bouchard; Power: *
C117 C122 = CAP - 1210: Precision: 10%; Current: *; CreatedBy: Jonathan Bouchard; Power: *
R99 R100 = RES - 0402: Voltage: 50V; Power: 1/16W; Current: *; CreatedBy: Jonathan Bouchard
SW1 = SWI_TACT_B3SN-3012P: SWI - TACT SPST-NO 0.05A 24V - 4-SMD; Current: 50mA; Mfg: Omron; Mfg Part Number: B3SN-3012P; HelpURL: http://www.omron.com/ecb/products/pdf/en-b3sn.pdf; CreatedBy: Jonathan Bouchard; Temperature: -25°C ~ 70°C; Power: *; Precision: *; Package: 4-SMD; Value: *; Voltage: 24V; Supplier 1: Digikey; Supplier Part Number 1: SW261CT-ND
U12 = FPGA_XC6SLX100-3FGG676C: as U12 on sheet CM_FPGA_B0-1; Current: *; Power: *; Mfg: Xilinx; Mfg Part Number: XC6SLX100-3FGG676C; HelpURL: https://www.xilinx.com/support/documentation/data_sheets/ds162.pdf; CreatedBy: Jonathan Bouchard; Temperature: 0°C ~ 85°C (TJ); Value: *; Precision: *; Package: BGA-676; Supplier 1: Digikey; Supplier Part Number 1: 122-1760-ND

## Sheet CM_FPGA_B4-5.SchDoc
size Tabloid; SheetNumber: 6; SheetTotal: 14; Sheet_Name: CM_FPGA_B4-5; Size: 11x17
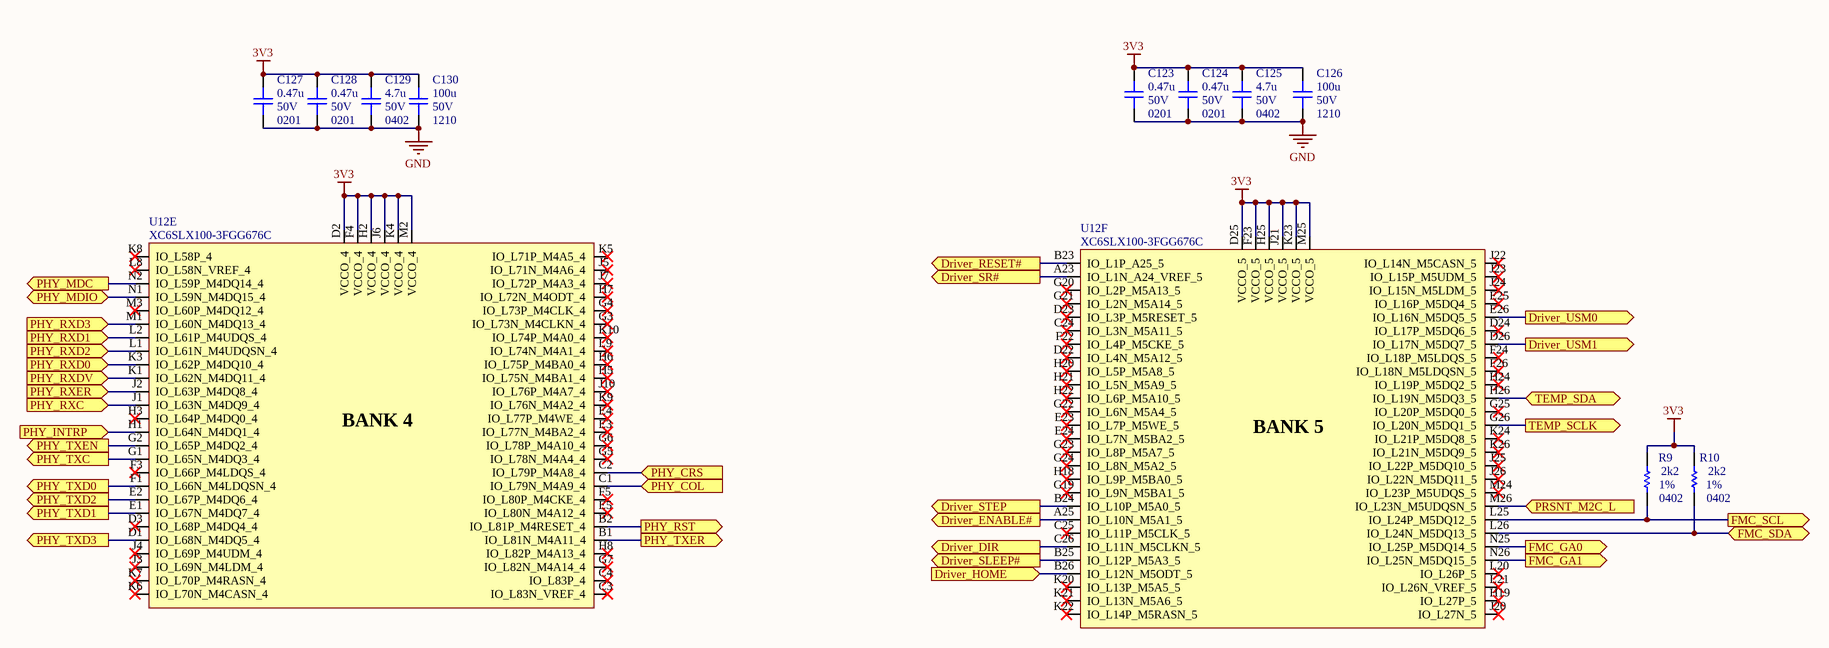
[diagram p5: CM_FPGA_B4-5.SchDoc]

### Parts
C123  value 0.47u  Voltage: 50V  Package: 0201  [CAP_0201]  (hidden comment: CAP - 0201)
C124  value 0.47u  Voltage: 50V  Package: 0201  [CAP_0201]  (hidden comment: CAP - 0201)
C125  value 4.7u  Voltage: 50V  Package: 0402  [CAP_0402]  (hidden comment: CAP - 0402)
C126  value 100u  Voltage: 50V  Package: 1210  [CAP_1210]  (hidden comment: CAP - 1210)
C127  value 0.47u  Voltage: 50V  Package: 0201  [CAP_0201]  (hidden comment: CAP - 0201)
C128  value 0.47u  Voltage: 50V  Package: 0201  [CAP_0201]  (hidden comment: CAP - 0201)
C129  value 4.7u  Voltage: 50V  Package: 0402  [CAP_0402]  (hidden comment: CAP - 0402)
C130  value 100u  Voltage: 50V  Package: 1210  [CAP_1210]  (hidden comment: CAP - 1210)
R9  value 2k2  Package: 0402  Precision: 1%  [RES_0402]  (hidden comment: RES - 0402)
R10  value 2k2  Package: 0402  Precision: 1%  [RES_0402]  (hidden comment: RES - 0402)
U12  XC6SLX100-3FGG676C  [FPGA_XILINX_FGG676]  (parts E,F of 10)

### Ports
Driver_DIR (out), Driver_ENABLE# (out), Driver_HOME (in), Driver_RESET# (out), Driver_SLEEP# (out), Driver_SR# (out), Driver_STEP (out), Driver_USM0 (out), Driver_USM1 (out), FMC_GA0 (out), FMC_GA1 (out), FMC_SCL (out), FMC_SDA (bidir), PHY_COL (in), PHY_CRS (in), PHY_INTRP (in), PHY_MDC (out), PHY_MDIO (bidir), PHY_RST (out), PHY_RXC (in), PHY_RXD0 (in), PHY_RXD1 (in), PHY_RXD2 (in), PHY_RXD3 (in), PHY_RXDV (in), PHY_RXER (in), PHY_TXC (out), PHY_TXD0 (out), PHY_TXD1 (out), PHY_TXD2 (out), PHY_TXD3 (out), PHY_TXEN (out), PHY_TXER (out), PRSNT_M2C_L (in), TEMP_SCLK (out), TEMP_SDA (bidir)

### Nets
3V3: C123.2 C124.2 C125.2 C126.2 C127.2 C128.2 C129.2 C130.2 R9.2 R10.2 U12.D2(VCCO_4) U12.D25(VCCO_5) U12.F4(VCCO_4) U12.F23(VCCO_5) U12.H2(VCCO_4) U12.H25(VCCO_5) U12.J6(VCCO_4) U12.J21(VCCO_5) U12.K4(VCCO_4) U12.K23(VCCO_5) U12.M2(VCCO_4) U12.M25(VCCO_5)
GND: C123.1 C124.1 C125.1 C126.1 C127.1 C128.1 C129.1 C130.1
Driver_DIR: U12.C26(IO_L11N_M5CLKN_5) ; port Driver_DIR
Driver_ENABLE#: U12.A25(IO_L10N_M5A1_5) ; port Driver_ENABLE#
Driver_HOME: U12.B26(IO_L12N_M5ODT_5) ; port Driver_HOME
Driver_RESET#: U12.B23(IO_L1P_A25_5) ; port Driver_RESET#
Driver_SLEEP#: U12.B25(IO_L12P_M5A3_5) ; port Driver_SLEEP#
Driver_SR#: U12.A23(IO_L1N_A24_VREF_5) ; port Driver_SR#
Driver_STEP: U12.B24(IO_L10P_M5A0_5) ; port Driver_STEP
Driver_USM0: U12.E26(IO_L16N_M5DQ5_5) ; port Driver_USM0
Driver_USM1: U12.D26(IO_L17N_M5DQ7_5) ; port Driver_USM1
FMC_GA0: U12.N25(IO_L25P_M5DQ14_5) ; port FMC_GA0
FMC_GA1: U12.N26(IO_L25N_M5DQ15_5) ; port FMC_GA1
FMC_SCL: R9.1 U12.L25(IO_L24P_M5DQ12_5) ; port FMC_SCL
FMC_SDA: R10.1 U12.L26(IO_L24N_M5DQ13_5) ; port FMC_SDA
PHY_COL: U12.C1(IO_L79N_M4A9_4) ; port PHY_COL
PHY_CRS: U12.C2(IO_L79P_M4A8_4) ; port PHY_CRS
PHY_INTRP: U12.H1(IO_L64N_M4DQ1_4) ; port PHY_INTRP
PHY_MDC: U12.N2(IO_L59P_M4DQ14_4) ; port PHY_MDC
PHY_MDIO: U12.N1(IO_L59N_M4DQ15_4) ; port PHY_MDIO
PHY_RST: U12.B2(IO_L81P_M4RESET_4) ; port PHY_RST
PHY_RXC: U12.J1(IO_L63N_M4DQ9_4) ; port PHY_RXC
PHY_RXD0: U12.K3(IO_L62P_M4DQ10_4) ; port PHY_RXD0
PHY_RXD1: U12.L2(IO_L61P_M4UDQS_4) ; port PHY_RXD1
PHY_RXD2: U12.L1(IO_L61N_M4UDQSN_4) ; port PHY_RXD2
PHY_RXD3: U12.M1(IO_L60N_M4DQ13_4) ; port PHY_RXD3
PHY_RXDV: U12.K1(IO_L62N_M4DQ11_4) ; port PHY_RXDV
PHY_RXER: U12.J2(IO_L63P_M4DQ8_4) ; port PHY_RXER
PHY_TXC: U12.G1(IO_L65N_M4DQ3_4) ; port PHY_TXC
PHY_TXD0: U12.F1(IO_L66N_M4LDQSN_4) ; port PHY_TXD0
PHY_TXD1: U12.E1(IO_L67N_M4DQ7_4) ; port PHY_TXD1
PHY_TXD2: U12.E2(IO_L67P_M4DQ6_4) ; port PHY_TXD2
PHY_TXD3: U12.D1(IO_L68N_M4DQ5_4) ; port PHY_TXD3
PHY_TXEN: U12.G2(IO_L65P_M4DQ2_4) ; port PHY_TXEN
PHY_TXER: U12.B1(IO_L81N_M4A11_4) ; port PHY_TXER
PRSNT_M2C_L: U12.M26(IO_L23N_M5UDQSN_5) ; port PRSNT_M2C_L
TEMP_SCLK: U12.G26(IO_L20N_M5DQ1_5) ; port TEMP_SCLK
TEMP_SDA: U12.H26(IO_L19N_M5DQ3_5) ; port TEMP_SDA

Not connected (* = marked no-connect by the designer): U12 C3(IO_L83N_VREF_4)* C4(IO_L83P_4)* C24(IO_L3N_M5A11_5)* C25(IO_L11P_M5CLK_5)* D3(IO_L68P_M4DQ4_4)* D22(IO_L4N_M5A12_5)* D23(IO_L3P_M5RESET_5)* D24(IO_L17P_M5DQ6_5)* E3(IO_L77N_M4BA2_4)* E4(IO_L77P_M4WE_4)* E5(IO_L80N_M4A12_4)* E23(IO_L7P_M5WE_5)* E24(IO_L7N_M5BA2_5)* E25(IO_L16P_M5DQ4_5)* F3(IO_L66P_M4LDQS_4)* F5(IO_L80P_M4CKE_4)* F22(IO_L4P_M5CKE_5)* F24(IO_L18P_M5LDQS_5)* F26(IO_L18N_M5LDQSN_5)* G3(IO_L73N_M4CLKN_4)* G4(IO_L73P_M4CLK_4)* G5(IO_L78N_M4A4_4)* G6(IO_L78P_M4A10_4)* G7(IO_L82N_M4A14_4)* G19(IO_L9N_M5BA1_5)* G20(IO_L2P_M5A13_5)* G21(IO_L2N_M5A14_5)* G22(IO_L6N_M5A4_5)* G23(IO_L8P_M5A7_5)* G24(IO_L8N_M5A2_5)* G25(IO_L20P_M5DQ0_5)* H3(IO_L64P_M4DQ0_4)* H5(IO_L75N_M4BA1_4)* H6(IO_L75P_M4BA0_4)* H7(IO_L72N_M4ODT_4)* H8(IO_L82P_M4A13_4)* H18(IO_L9P_M5BA0_5)* H19(IO_L27P_5)* H20(IO_L5P_M5A8_5)* H21(IO_L5N_M5A9_5)* H22(IO_L6P_M5A10_5)* H24(IO_L19P_M5DQ2_5)* J3(IO_L69N_M4LDM_4)* J4(IO_L69P_M4UDM_4)* J5(IO_L71N_M4A6_4)* J7(IO_L72P_M4A3_4)* J10(IO_L76P_M4A7_4)* J20(IO_L27N_5)* J22(IO_L14N_M5CASN_5)* J23(IO_L15P_M5UDM_5)* J24(IO_L15N_M5LDM_5)* J25(IO_L22P_M5DQ10_5)* J26(IO_L22N_M5DQ11_5)* K5(IO_L71P_M4A5_4)* K6(IO_L70N_M4CASN_4)* K7(IO_L70P_M4RASN_4)* K8(IO_L58P_4)* K9(IO_L76N_M4A2_4)* K10(IO_L74P_M4A0_4)* K20(IO_L13P_M5A5_5)* K21(IO_L13N_M5A6_5)* K22(IO_L14P_M5RASN_5)* K24(IO_L21P_M5DQ8_5)* K26(IO_L21N_M5DQ9_5)* L8(IO_L58N_VREF_4)* L9(IO_L74N_M4A1_4)* L20(IO_L26P_5)* L21(IO_L26N_VREF_5)* M3(IO_L60P_M4DQ12_4)* M24(IO_L23P_M5UDQS_5)*

### Notes on the sheet
- Sheet Name
- Project Title
- Global Project
- Size
- Group
- Revision
- Date
- Sheet
- of
- Filename
- Designers
- (in symbol FPGA_XC6SLX100-3FGG676C, part E) BANK 4
- (in symbol FPGA_XC6SLX100-3FGG676C, part F) BANK 5

### Library data of the parts
C123 C124 C127 C128 = CAP - 0201: Precision: 10%; Current: *; CreatedBy: Jonathan Bouchard; Power: *
C125 C129 = CAP - 0402: Precision: 10%; Current: *; CreatedBy: Jonathan Bouchard; Power: *
C126 C130 = CAP - 1210: Precision: 10%; Current: *; CreatedBy: Jonathan Bouchard; Power: *
R9 R10 = RES - 0402: Voltage: 50V; Power: 1/16W; Current: *; CreatedBy: Jonathan Bouchard
U12 = FPGA_XC6SLX100-3FGG676C: as U12 on sheet CM_FPGA_B0-1; Current: *; Power: *; Mfg: Xilinx; Mfg Part Number: XC6SLX100-3FGG676C; HelpURL: https://www.xilinx.com/support/documentation/data_sheets/ds162.pdf; CreatedBy: Jonathan Bouchard; Temperature: 0°C ~ 85°C (TJ); Value: *; Precision: *; Package: BGA-676; Supplier 1: Digikey; Supplier Part Number 1: 122-1760-ND

## Sheet CM_FPGA_JTAG_POWER_FLASH.SchDoc
size Tabloid; SheetNumber: 7; SheetTotal: 14; Sheet_Name: CM_FPGA_JTAG_POWER_FLASH; Size: 11x17
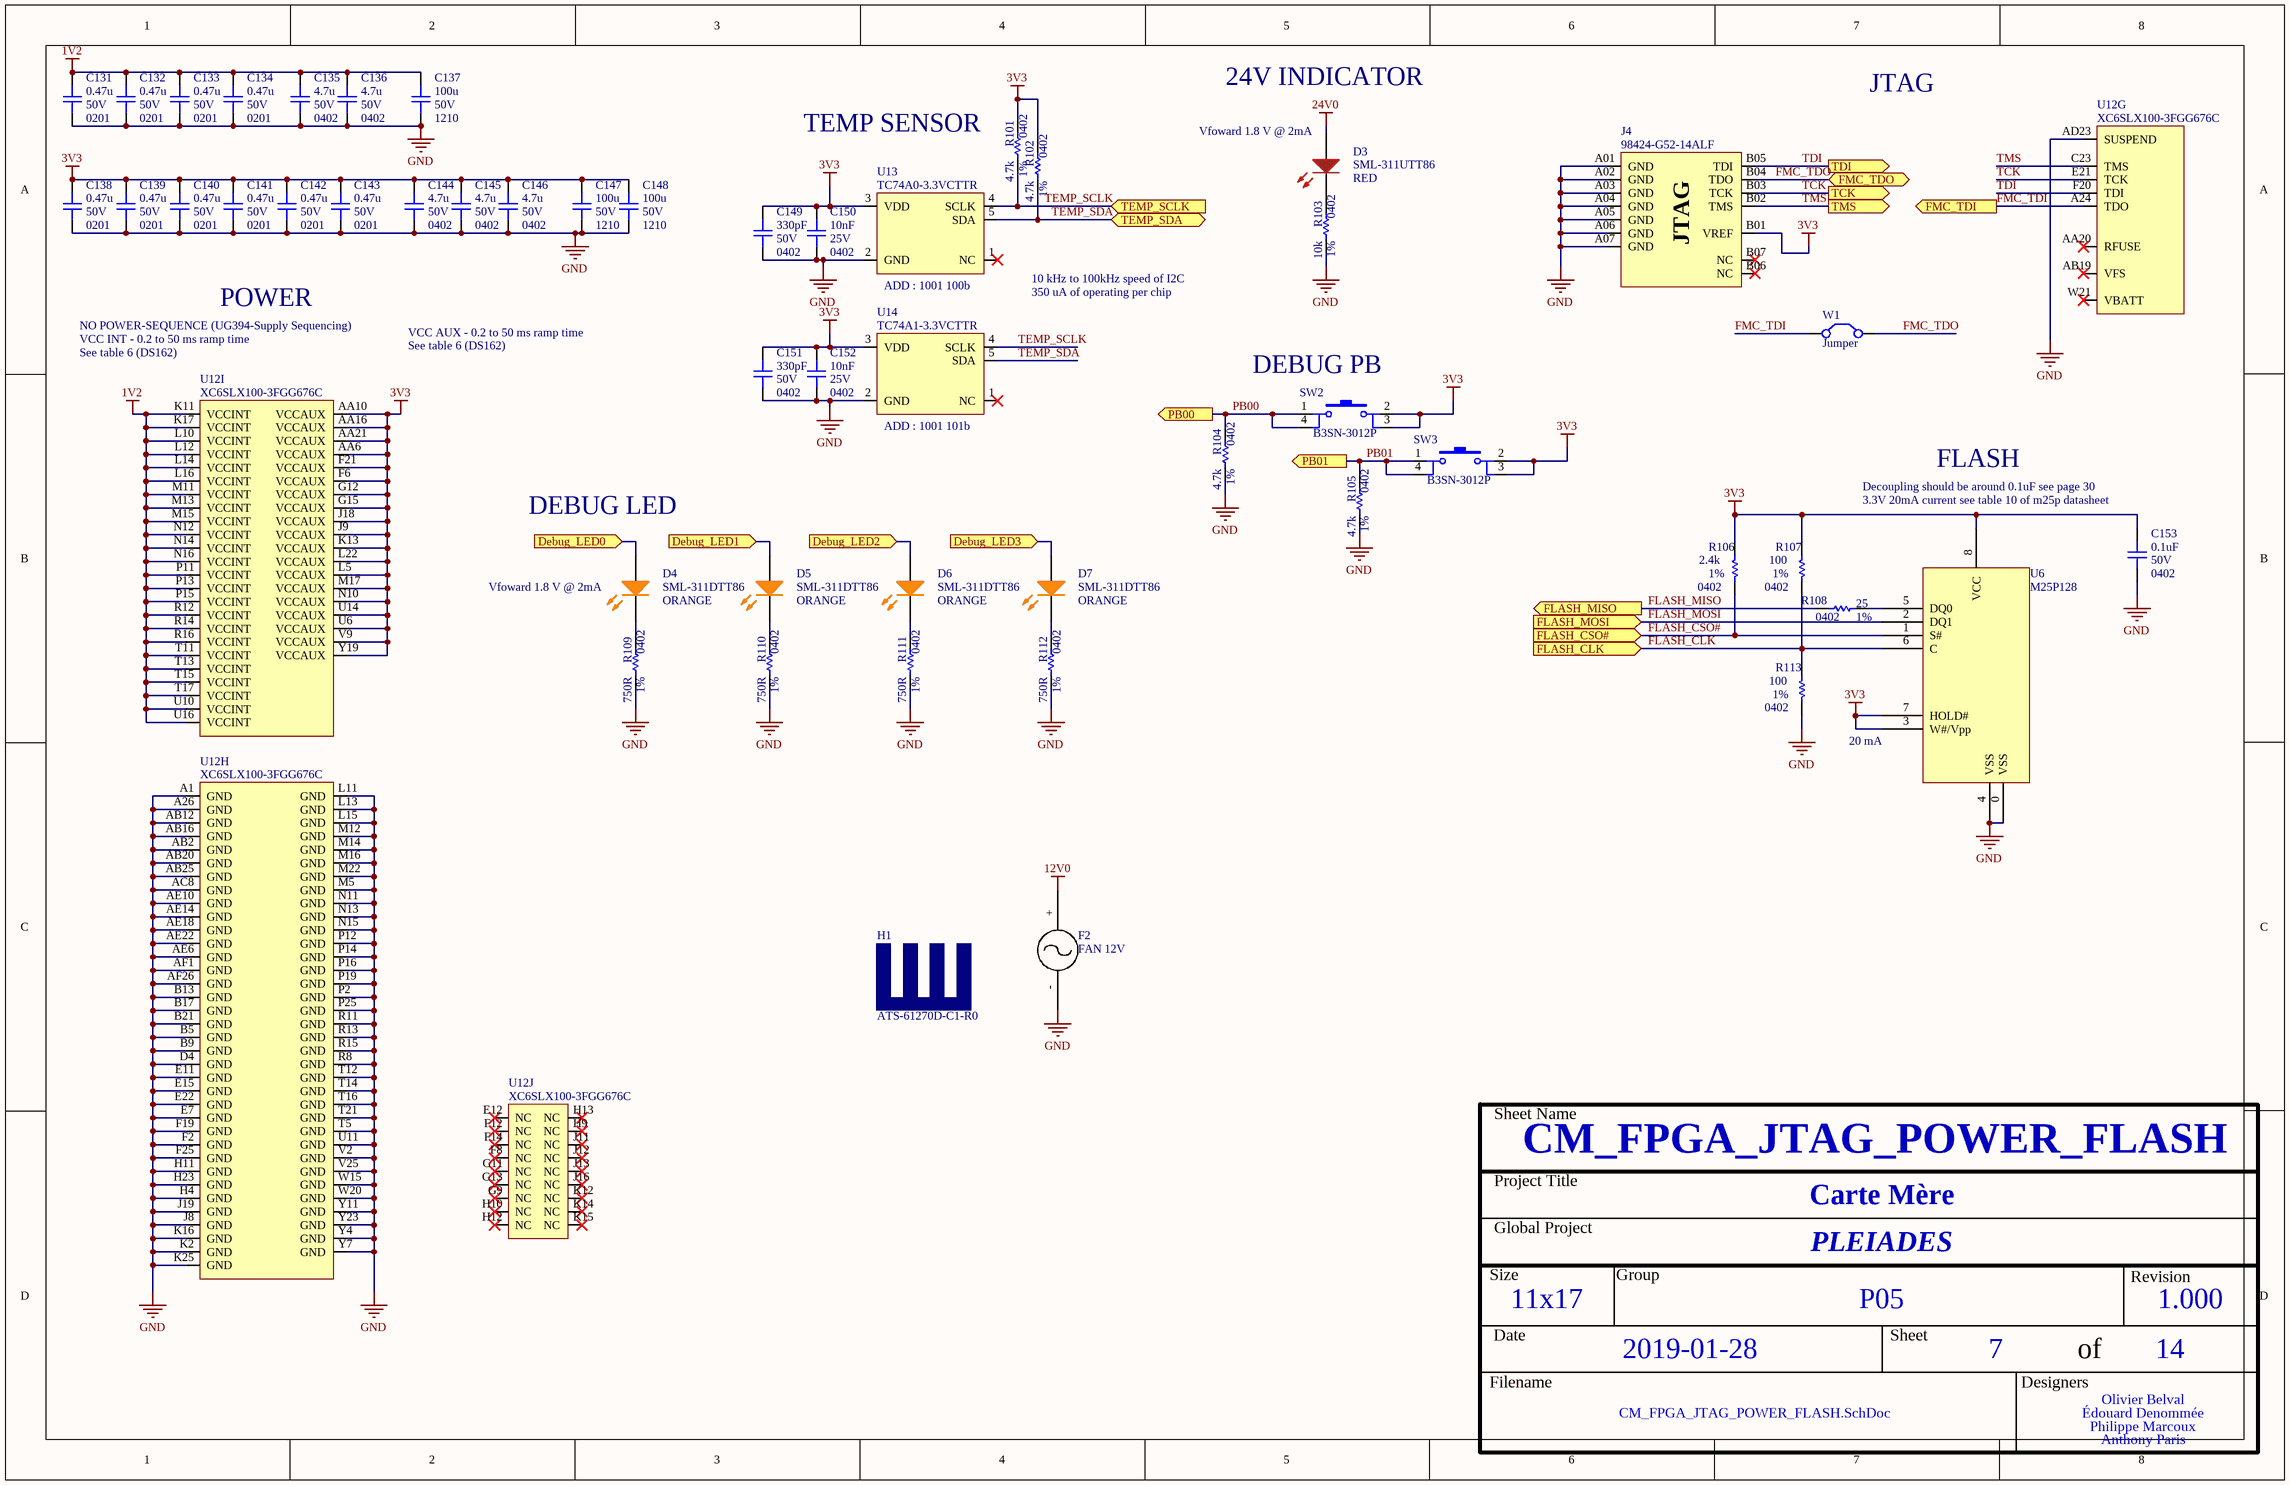
[diagram p6: CM_FPGA_JTAG_POWER_FLASH.SchDoc]

### Parts
C131  value 0.47u  Voltage: 50V  Package: 0201  [CAP_0201]  (hidden comment: CAP - 0201)
C132  value 0.47u  Voltage: 50V  Package: 0201  [CAP_0201]  (hidden comment: CAP - 0201)
C133  value 0.47u  Voltage: 50V  Package: 0201  [CAP_0201]  (hidden comment: CAP - 0201)
C134  value 0.47u  Voltage: 50V  Package: 0201  [CAP_0201]  (hidden comment: CAP - 0201)
C135  value 4.7u  Voltage: 50V  Package: 0402  [CAP_0402]  (hidden comment: CAP - 0402)
C136  value 4.7u  Voltage: 50V  Package: 0402  [CAP_0402]  (hidden comment: CAP - 0402)
C137  value 100u  Voltage: 50V  Package: 1210  [CAP_1210]  (hidden comment: CAP - 1210)
C138  value 0.47u  Voltage: 50V  Package: 0201  [CAP_0201]  (hidden comment: CAP - 0201)
C139  value 0.47u  Voltage: 50V  Package: 0201  [CAP_0201]  (hidden comment: CAP - 0201)
C140  value 0.47u  Voltage: 50V  Package: 0201  [CAP_0201]  (hidden comment: CAP - 0201)
C141  value 0.47u  Voltage: 50V  Package: 0201  [CAP_0201]  (hidden comment: CAP - 0201)
C142  value 0.47u  Voltage: 50V  Package: 0201  [CAP_0201]  (hidden comment: CAP - 0201)
C143  value 0.47u  Voltage: 50V  Package: 0201  [CAP_0201]  (hidden comment: CAP - 0201)
C144  value 4.7u  Voltage: 50V  Package: 0402  [CAP_0402]  (hidden comment: CAP - 0402)
C145  value 4.7u  Voltage: 50V  Package: 0402  [CAP_0402]  (hidden comment: CAP - 0402)
C146  value 4.7u  Voltage: 50V  Package: 0402  [CAP_0402]  (hidden comment: CAP - 0402)
C147  value 100u  Voltage: 50V  Package: 1210  [CAP_1210]  (hidden comment: CAP - 1210)
C148  value 100u  Voltage: 50V  Package: 1210  [CAP_1210]  (hidden comment: CAP - 1210)
C149  value 330pF  Voltage: 50V  Package: 0402  [CAP_0402]  (hidden comment: CAP - 0402)
C150  value 10nF  Voltage: 25V  Package: 0402  [CAP_0402]  (hidden comment: CAP - 0402)
C151  value 330pF  Voltage: 50V  Package: 0402  [CAP_0402]  (hidden comment: CAP - 0402)
C152  value 10nF  Voltage: 25V  Package: 0402  [CAP_0402]  (hidden comment: CAP - 0402)
C153  value 0.1uF  Voltage: 50V  Package: 0402  [CAP_0402]  (hidden comment: CAP - 0402)
D3  SML-311UTT86  value RED  [LED_0603]
D4  SML-311DTT86  value ORANGE  [LED_0603]
D5  SML-311DTT86  value ORANGE  [LED_0603]
D6  SML-311DTT86  value ORANGE  [LED_0603]
D7  SML-311DTT86  value ORANGE  [LED_0603]
F2  FAN 12V  [HDR1X2]
H1  ATS-61270D-C1-R0  [27mm heatsink]
J4  98424-G52-14ALF  [CON_JTAG_98424-G52-14ALF]
R101  value 4.7k  Package: 0402  Precision: 1%  [RES_0402]  (hidden comment: RES - 0402)
R102  value 4.7k  Package: 0402  Precision: 1%  [RES_0402]  (hidden comment: RES - 0402)
R103  value 10k  Package: 0402  Precision: 1%  [RES_0402]  (hidden comment: RES - 0402)
R104  value 4.7k  Package: 0402  Precision: 1%  [RES_0402]  (hidden comment: RES - 0402)
R105  value 4.7k  Package: 0402  Precision: 1%  [RES_0402]  (hidden comment: RES - 0402)
R106  value 2.4k  Package: 0402  Precision: 1%  [RES_0402]  (hidden comment: RES - 0402)
R107  value 100  Package: 0402  Precision: 1%  [RES_0402]  (hidden comment: RES - 0402)
R108  value 25  Package: 0402  Precision: 1%  [RES_0402]  (hidden comment: RES - 0402)
R109  value 750R  Package: 0402  Precision: 1%  [RES_0402]  (hidden comment: RES - 0402)
R110  value 750R  Package: 0402  Precision: 1%  [RES_0402]  (hidden comment: RES - 0402)
R111  value 750R  Package: 0402  Precision: 1%  [RES_0402]  (hidden comment: RES - 0402)
R112  value 750R  Package: 0402  Precision: 1%  [RES_0402]  (hidden comment: RES - 0402)
R113  value 100  Package: 0402  Precision: 1%  [RES_0402]  (hidden comment: RES - 0402)
SW2  B3SN-3012P  [SWI_TACT_B3SN-3012P]
SW3  B3SN-3012P  [SWI_TACT_B3SN-3012P]
U6  M25P128  [M25P128]
U12  XC6SLX100-3FGG676C  [FPGA_XILINX_FGG676]  (parts G,H,I,J of 10)
U13  TC74A0-3.3VCTTR  [SEN_TEMP_TC74A0-3.3VCTTR]
U14  TC74A1-3.3VCTTR  [SEN_TEMP_TC74A0-3.3VCTTR]
W1  Jumper  [RAD-0.2]

### Ports
Debug_LED0 (in), Debug_LED1 (in), Debug_LED2 (in), Debug_LED3 (in), FLASH_CLK (in), FLASH_CSO# (in), FLASH_MISO (out), FLASH_MOSI (in), FMC_TDI (out), FMC_TDO, PB00 (out), PB01 (out), TCK (out), TDI (out), TEMP_SCLK (in), TEMP_SDA (bidir), TMS (out)

### Nets
1V2: C131.2 C132.2 C133.2 C134.2 C135.2 C136.2 C137.2 U12.K11(VCCINT) U12.K17(VCCINT) U12.L10(VCCINT) U12.L12(VCCINT) U12.L14(VCCINT) U12.L16(VCCINT) U12.M11(VCCINT) U12.M13(VCCINT) U12.M15(VCCINT) U12.N12(VCCINT) U12.N14(VCCINT) U12.N16(VCCINT) U12.P11(VCCINT) U12.P13(VCCINT) U12.P15(VCCINT) U12.R12(VCCINT) U12.R14(VCCINT) U12.R16(VCCINT) U12.T11(VCCINT) U12.T13(VCCINT) U12.T15(VCCINT) U12.T17(VCCINT) U12.U10(VCCINT) U12.U16(VCCINT)
3V3: C138.2 C139.2 C140.2 C141.2 C142.2 C143.2 C144.2 C145.2 C146.2 C147.2 C148.2 C149.2 C150.2 C151.2 C152.2 C153.2 J4.B01(VREF) R101.2 R102.2 R106.2 R107.2 SW2.2 SW2.3 SW3.2 SW3.3 U6.3(W#/Vpp) U6.7(HOLD#) U6.8(VCC) U12.AA6(VCCAUX) U12.AA10(VCCAUX) U12.AA16(VCCAUX) U12.AA21(VCCAUX) U12.F6(VCCAUX) U12.F21(VCCAUX) U12.G12(VCCAUX) U12.G15(VCCAUX) U12.J9(VCCAUX) U12.J18(VCCAUX) U12.K13(VCCAUX) U12.L5(VCCAUX) U12.L22(VCCAUX) U12.M17(VCCAUX) U12.N10(VCCAUX) U12.U6(VCCAUX) U12.U14(VCCAUX) U12.V9(VCCAUX) U12.Y19(VCCAUX) U13.3(VDD) U14.3(VDD)
12V0: F2.+
24V0: D3.A
GND: C131.1 C132.1 C133.1 C134.1 C135.1 C136.1 C137.1 C138.1 C139.1 C140.1 C141.1 C142.1 C143.1 C144.1 C145.1 C146.1 C147.1 C148.1 C149.1 C150.1 C151.1 C152.1 C153.1 F2.- J4.A01(GND) J4.A02(GND) J4.A03(GND) J4.A04(GND) J4.A05(GND) J4.A06(GND) J4.A07(GND) R103.1 R104.1 R105.1 R109.1 R110.1 R111.1 R112.1 R113.1 U6.0(VSS) U6.4(VSS) U12.A1(GND) U12.A26(GND) U12.AB2(GND) U12.AB12(GND) U12.AB16(GND) U12.AB20(GND) U12.AB25(GND) U12.AC8(GND) U12.AD23(SUSPEND) U12.AE6(GND) U12.AE10(GND) U12.AE14(GND) U12.AE18(GND) U12.AE22(GND) U12.AF1(GND) U12.AF26(GND) U12.B5(GND) U12.B9(GND) U12.B13(GND) U12.B17(GND) U12.B21(GND) U12.D4(GND) U12.E7(GND) U12.E11(GND) U12.E15(GND) U12.E22(GND) U12.F2(GND) U12.F19(GND) U12.F25(GND) U12.H4(GND) U12.H11(GND) U12.H23(GND) U12.J8(GND) U12.J19(GND) U12.K2(GND) U12.K16(GND) U12.K25(GND) U12.L11(GND) U12.L13(GND) U12.L15(GND) U12.M5(GND) U12.M12(GND) U12.M14(GND) U12.M16(GND) U12.M22(GND) U12.N11(GND) U12.N13(GND) U12.N15(GND) U12.P2(GND) U12.P12(GND) U12.P14(GND) U12.P16(GND) U12.P19(GND) U12.P25(GND) U12.R8(GND) U12.R11(GND) U12.R13(GND) U12.R15(GND) U12.T5(GND) U12.T12(GND) U12.T14(GND) U12.T16(GND) U12.T21(GND) U12.U11(GND) U12.V2(GND) U12.V25(GND) U12.W15(GND) U12.W20(GND) U12.Y4(GND) U12.Y7(GND) U12.Y11(GND) U12.Y23(GND) U13.2(GND) U14.2(GND)
Debug_LED0: D4.A ; port Debug_LED0
Debug_LED1: D5.A ; port Debug_LED1
Debug_LED2: D6.A ; port Debug_LED2
Debug_LED3: D7.A ; port Debug_LED3
FLASH_CLK: R107.1 R113.2 U6.6(C) ; port FLASH_CLK
FLASH_CSO#: R106.1 U6.1(S#) ; port FLASH_CSO#
FLASH_MISO: R108.1 ; port FLASH_MISO
FLASH_MOSI: U6.2(DQ1) ; port FLASH_MOSI
FMC_TDI: U12.A24(TDO) W1.1(C1) ; port FMC_TDI
FMC_TDO: J4.B04(TDO) W1.2(C2) ; port FMC_TDO
PB00: R104.2 SW2.1 SW2.4 ; port PB00
PB01: R105.2 SW3.1 SW3.4 ; port PB01
TCK: J4.B03(TCK) U12.E21(TCK) ; port TCK
TDI: J4.B05(TDI) U12.F20(TDI) ; port TDI
TEMP_SCLK: R101.1 U13.4(SCLK) U14.4(SCLK) ; port TEMP_SCLK
TEMP_SDA: R102.1 U13.5(SDA) U14.5(SDA) ; port TEMP_SDA
TMS: J4.B02(TMS) U12.C23(TMS) ; port TMS
NetD3_K: D3.K R103.2
NetD4_K: D4.K R109.2
NetD5_K: D5.K R110.2
NetD6_K: D6.K R111.2
NetD7_K: D7.K R112.2
NetR108_2: R108.2 U6.5(DQ0)

Not connected (* = marked no-connect by the designer): J4 B06(NC)* B07(NC)*; U12 AA20(RFUSE)* AB19(VFS)* E12(NC)* F8(NC)* F12(NC)* F14(NC)* G9(NC)* G11(NC)* G13(NC)* H9(NC)* H10(NC)* H12(NC)* H13(NC)* J11(NC)* J12(NC)* J13(NC)* J16(NC)* K12(NC)* K14(NC)* K15(NC)* W21(VBATT)*; U13 1(NC)*; U14 1(NC)*

### Notes on the sheet
- 24V INDICATOR
- JTAG
- TEMP SENSOR
- (near D3) Vfoward 1.8 V @ 2mA
- (near U13) ADD : 1001 100b
- 10 kHz to 100kHz speed of I2C
- 350 uA of operating per chip
- VCC INT - 0.2 to 50 ms ramp time
- See table 6 (DS162)
- NO POWER-SEQUENCE (UG394-Supply Sequencing)
- POWER
- VCC AUX - 0.2 to 50 ms ramp time
- (near U14) ADD : 1001 101b
- (near SW2) DEBUG PB
- Decoupling should be around 0.1uF see page 30
- FLASH
- DEBUG LED
- (near C153) 3.3V 20mA current see table 10 of m25p datasheet
- (near D4) Vfoward 1.8 V @ 2mA
- 20 mA
- Sheet Name
- Project Title
- Global Project
- Size
- Group
- Revision
- Date
- Sheet
- of
- Filename
- Designers
- (in symbol CONN_JTAG_98424-G52-14ALF) JTAG

### Library data of the parts
C131-C134 C138-C143 = CAP - 0201: Precision: 10%; Current: *; CreatedBy: Jonathan Bouchard; Power: *
C135 C136 C144-C146 C149-C153 = CAP - 0402: Precision: 10%; Current: *; CreatedBy: Jonathan Bouchard; Power: *
C137 C147 C148 = CAP - 1210: Precision: 10%; Current: *; CreatedBy: Jonathan Bouchard; Power: *
D3 = LED_SML-311UTT86: LED - 620nM RED 2mA - 0603; Voltage: 1.8V; Mfg: ROHM Semiconductor; Power: 44mW; Current: 2mA; HelpURL: http://media.digikey.com/pdf/Data%20Sheets/Rohm%20PDFs/SML-311%20Series.pdf; CreatedBy: Jonathan Bouchard; Temperature: -30°C to 85°C; Package: 0603; Precision: *; Mfg Part Number: SML-311UTT86; Supplier 1: Digikey; Supplier Part Number 1: 511-1304-1-ND
D4-D7 = LED_SML-311DTT86: LED - 611nM ORANGE 2mA - 0603; Voltage: 1.8V; Mfg: ROHM Semiconductor; Power: 44mW; Current: 2mA; HelpURL: http://media.digikey.com/pdf/Data%20Sheets/Rohm%20PDFs/SML-311%20Series.pdf; CreatedBy: Jonathan Bouchard; Temperature: -40°C to 85°C; Package: 0603; Precision: *; Mfg Part Number: SML-311DTT86; Supplier 1: Digikey; Supplier Part Number 1: 511-1303-1-ND
F2 = FAN 12V: pin to pad: +>1 ->2
H1 = ATS-61270D-C1-R0: 27mm Heatsink
J4 = CONN_JTAG_98424-G52-14ALF: CONN -  JTAG HEADER XILINX - 14-SMD; Mfg: Amphenol; Voltage: *; Current: *; Power: *; Mfg Part Number: 98424-G52-14ALF; HelpURL: http://portal.fciconnect.com/Comergent//fci/drawing/98424.pdf; CreatedBy: Jonathan Bouchard; Temperature: *; Value: *; Precision: *; Package: 14-SMD; Supplier 1: Digikey; Supplier Part Number 1: 609-2643-1-ND
R101-R113 = RES - 0402: Voltage: 50V; Power: 1/16W; Current: *; CreatedBy: Jonathan Bouchard
SW2 SW3 = SWI_TACT_B3SN-3012P: as SW1 on sheet CM_FPGA_B2-3; Mfg Part Number: B3SN-3012P; HelpURL: http://www.omron.com/ecb/products/pdf/en-b3sn.pdf; CreatedBy: Jonathan Bouchard; Temperature: -25°C ~ 70°C; Power: *; Precision: *; Package: 4-SMD; Value: *; Voltage: 24V; Supplier 1: Digikey; Supplier Part Number 1: SW261CT-ND
U12 = FPGA_XC6SLX100-3FGG676C: as U12 on sheet CM_FPGA_B0-1; Current: *; Power: *; Mfg: Xilinx; Mfg Part Number: XC6SLX100-3FGG676C; HelpURL: https://www.xilinx.com/support/documentation/data_sheets/ds162.pdf; CreatedBy: Jonathan Bouchard; Temperature: 0°C ~ 85°C (TJ); Value: *; Precision: *; Package: BGA-676; Supplier 1: Digikey; Supplier Part Number 1: 122-1760-ND
U13 U14 = SENS_TEMP_TC74A0-3.3VCTTR: SENS - TEMPERATURE SENSOR I2C/SMBUS - SOT23-5; Voltage: 2.7 V ~ 5.5 V; Mfg: Microchip; Precision: ±2°C (±3°C); Current: *; Power: *; Mfg Part Number: TC74A0-3.3VCTTR; HelpURL: http://ww1.microchip.com/downloads/en/DeviceDoc/21462D.pdf; CreatedBy: Jonathan Bouchard; Temperature: -40°C ~ 125°C; Value: *; Package: SOT23-5; Supplier 1: Digikey; Supplier Part Number 1: TC74A0-3.3VCTDKR-ND
W1 = Jumper: Jumper Wire; Published: 24-Mar-1999; LatestRevisionDate: 17-Jul-2002; LatestRevisionNote: Re-released for DXP Platform.; PackageReference: RAD-0.2; Publisher: Altium Limited; PackageDescription: Radial Cap, Thru-Hole; 2 Leads; 0.2 in Pin Spacing